# EAGLE design JuiceBoard.3.9.2020 (EAGLE 9.1.3)
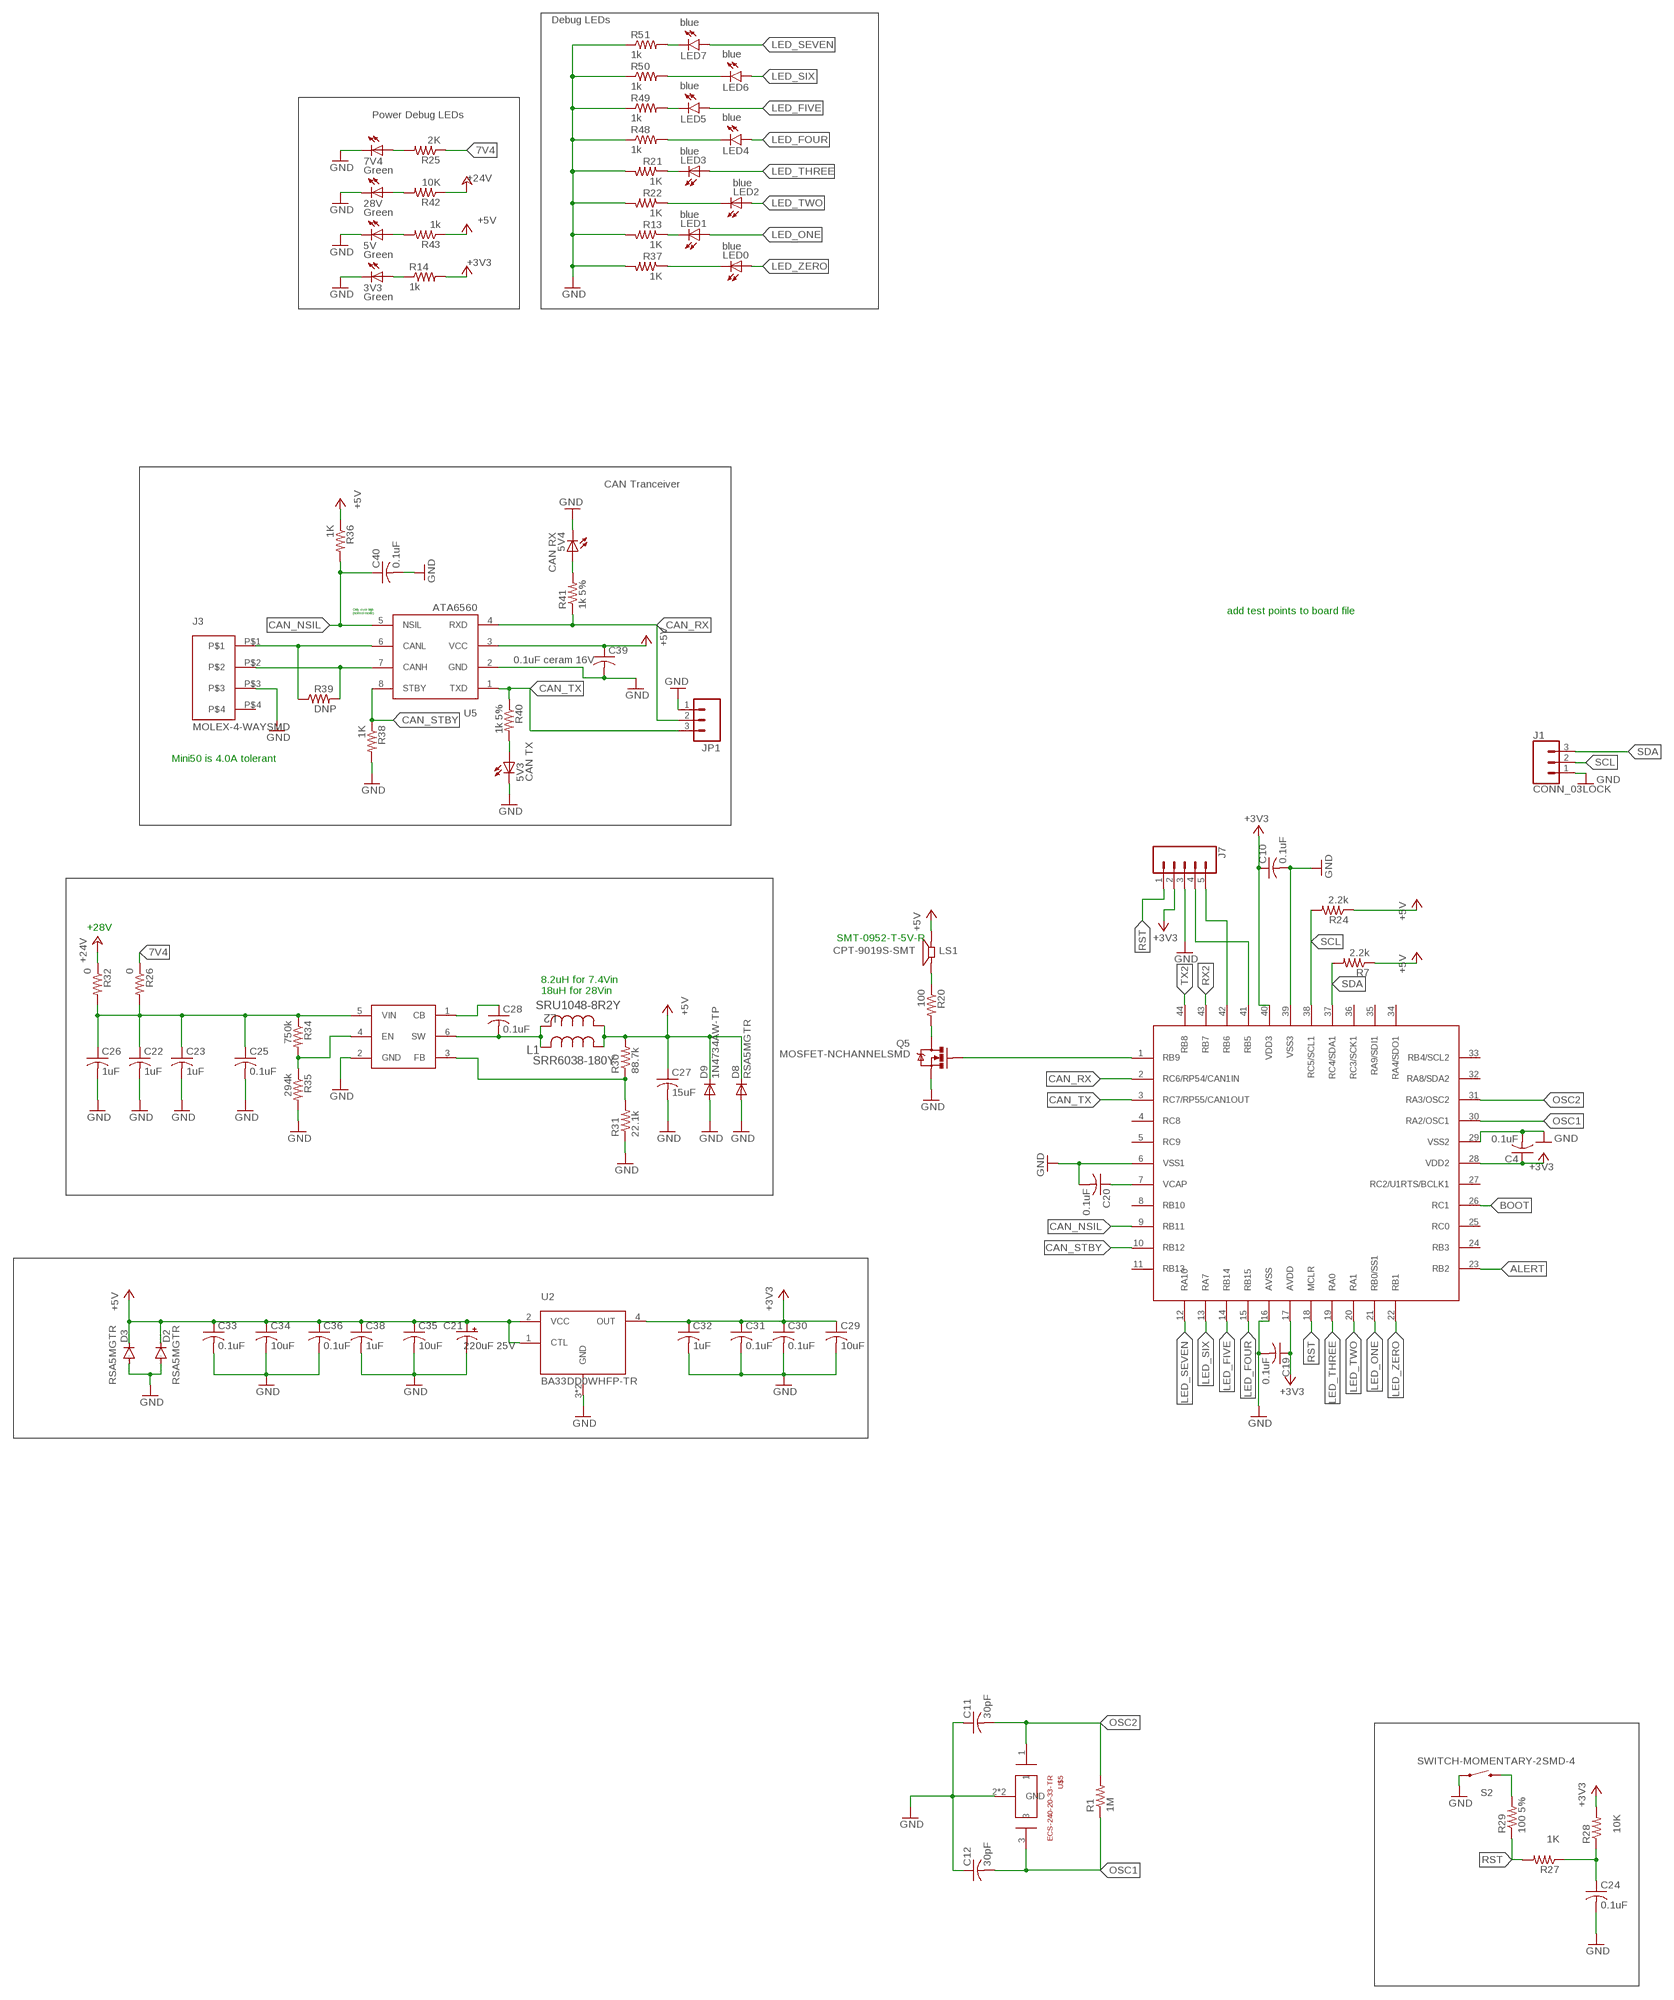
[diagram p0: schematic, sheet 1, part 1 of 2]
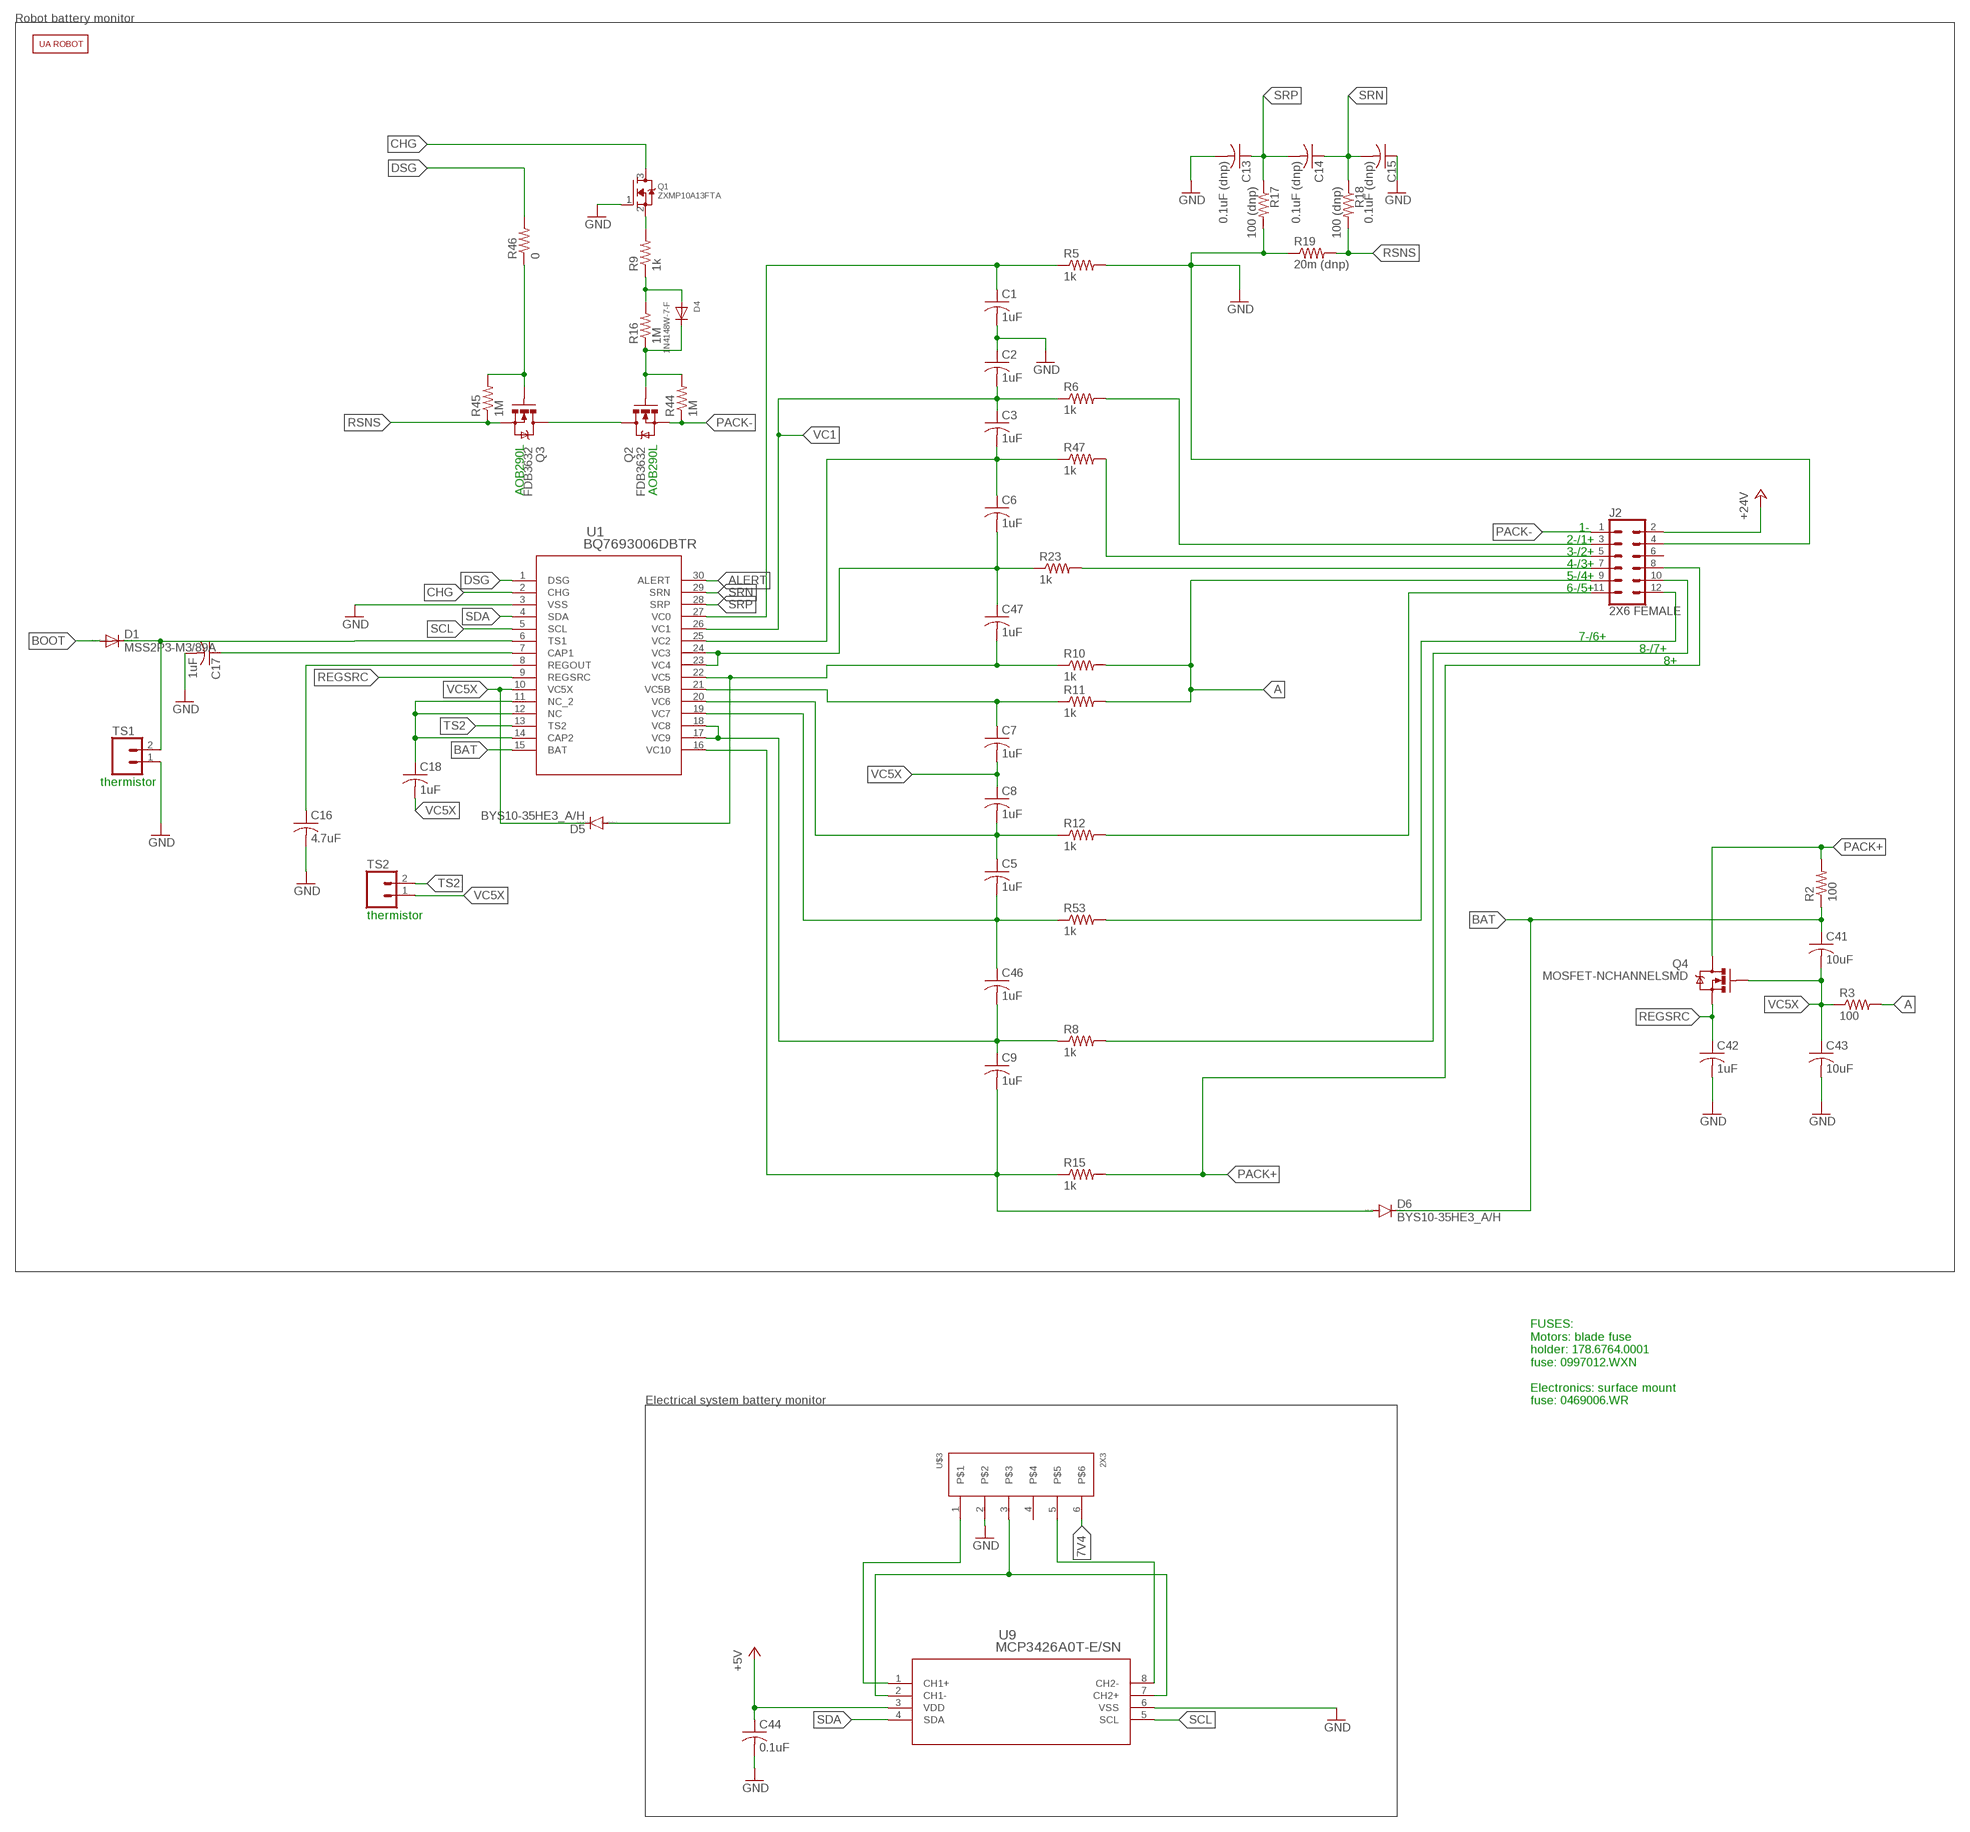
[diagram p1: schematic, sheet 1, part 2 of 2]

## Parts
3V3  Green  LEDCHIPLED_0805  [CHIPLED_0805]
5V  Green  LEDCHIP-LED0805  [CHIP-LED0805]
5V3  CAN TX  LEDCHIP-LED0805  [CHIP-LED0805]
5V4  CAN RX  LEDCHIP-LED0805  [CHIP-LED0805]
7V4  Green  LEDCHIP-LED0805  [CHIP-LED0805]
28V  Green  LEDCHIP-LED0805  [CHIP-LED0805]
A1  NASA_LOGO  [ROOBOT1]
C1  1uF  C-USC0805  [C0805]
C2  1uF  C-USC0805  [C0805]
C3  1uF  C-USC0805  [C0805]
C4  0.1uF  C-USC0805  [C0805]
C5  1uF  C-USC0805  [C0805]
C6  1uF  C-USC0805  [C0805]
C7  1uF  C-USC0805  [C0805]
C8  1uF  C-USC0805  [C0805]
C9  1uF  C-USC0805  [C0805]
C10  0.1uF  C-USC0805  [C0805]
C11  30pF  C-US_0805C0805  [C0805]
C12  30pF  C-US_0805C0805  [C0805]
C13  0.1uF (dnp)  C-USC0805  [C0805]
C14  0.1uF (dnp)  C-USC0805  [C0805]
C15  0.1uF (dnp)  C-USC0805  [C0805]
C16  4.7uF  C-USC0805  [C0805]
C17  1uF  C-USC0805  [C0805]
C18  1uF  C-USC0805  [C0805]
C19  0.1uF  C-USC0805  [C0805]
C20  0.1uF  C-USC0805  [C0805]
C21  220uF 25V  CPOL-US140CLH-1014  [140CLH-1014]
C22  1uF  C-USC0805  [C0805]
C23  1uF  C-USC0805  [C0805]
C24  0.1uF  C-USC0805  [C0805]
C25  0.1uF  C-USC0805  [C0805]
C26  1uF  C-USC0805  [C0805]
C27  15uF  C-USC0805  [C0805]
C28  0.1uF  C-USC0805  [C0805]
C29  10uF  C-USC0805  [C0805]
C30  0.1uF  C-USC0805  [C0805]
C31  0.1uF  C-USC0805  [C0805]
C32  1uF  C-USC0805  [C0805]
C33  0.1uF  C-USC0805  [C0805]
C34  10uF  C-USC0805  [C0805]
C35  10uF  C-USC0805  [C0805]
C36  0.1uF  C-USC0805  [C0805]
C38  1uF  C-USC0805  [C0805]
C39  0.1uF ceram 16V  C-USC0805  [C0805]
C40  0.1uF  C-USC0805  [C0805]
C41  10uF  C-US_0805C0805  [C0805]
C42  1uF  C-US_0805C0805  [C0805]
C43  10uF  C-US_0805C0805  [C0805]
C44  0.1uF  C-US_0805C0805  [C0805]
C46  1uF  C-USC0805  [C0805]
C47  1uF  C-USC0805  [C0805]
D1  MSS2P3-M3/89A  DIODE-SOD123  [SOD123]
D2  RSA5MGTR  CGRM4004-G  [SOD-123_MINI-SMA]
D3  RSA5MGTR  CGRM4004-G  [SOD-123_MINI-SMA]
D4  1N4148W-7-F  DIODESOD-123  [SOD-123]
D5  BYS10-35HE3_A/H  DIODE-DO214AC  [DO214AC]
D6  BYS10-35HE3_A/H  DIODE-DO214AC  [DO214AC]
D8  RSA5MGTR  DIODE-SOD123  [SOD123]
D9  1N4734AW-TP  DIODE-SOD123  [SOD123]
J1  CONN_03LOCK  [1X03_LOCK]
J2  2X6 FEMALE  CONN_06X2PTH_FEMALE  [2X6]
J3  MOLEX-4-WAYSMD  [4-WAY-SMD-90D]
J7  CONN_05  [1X05]
JP1  M03LOCK  [1X03_LOCK]
L1  SRR6038-180Y  [IND_BOURNS_SRR6038]
L2  SRU1048-8R2Y  [IND_BOURNS_SRU1048]
LED0  blue  LEDCHIPLED_0805  [CHIPLED_0805]
LED1  blue  LEDCHIPLED_0805  [CHIPLED_0805]
LED2  blue  LEDCHIPLED_0805  [CHIPLED_0805]
LED3  blue  LEDCHIPLED_0805  [CHIPLED_0805]
LED4  blue  LEDS_0805CHIP-LED0805  [CHIP-LED0805]
LED5  blue  LEDS_0805CHIP-LED0805  [CHIP-LED0805]
LED6  blue  LEDS_0805CHIP-LED0805  [CHIP-LED0805]
LED7  blue  LEDS_0805CHIP-LED0805  [CHIP-LED0805]
LS1  CPT-9019S-SMT  [CUI_CPT-9019S-SMT]
Q1  ZXMP10A13FTA  MOSFET-NREFLOW  [SOT23]
Q2  FDB3632  [TO-263-2]
Q3  FDB3632  [TO-263-2]
Q4  MOSFET-NCHANNELSMD  [SOT23-3]
Q5  MOSFET-NCHANNELSMD  [SOT23-3]
R1  1M  R-US_0805R0805  [R0805]
R2  100  R-US_0805R0805  [R0805]
R3  100  R-US_0805R0805  [R0805]
R5  1k  R-US_M0805  [M0805]
R6  1k  R-US_M0805  [M0805]
R7  2.2k  R-US_0805R0805  [R0805]
R8  1k  R-US_M0805  [M0805]
R9  1k  R-US_0805R0805  [R0805]
R10  1k  R-US_M0805  [M0805]
R11  1k  R-US_M0805  [M0805]
R12  1k  R-US_M0805  [M0805]
R13  1K  R-US_M0805  [M0805]
R14  1k  R-US_M0805  [M0805]
R15  1k  R-US_M0805  [M0805]
R16  1M  R-US_0805R0805  [R0805]
R17  100 (dnp)  R-US_M0805  [M0805]
R18  100 (dnp)  R-US_M0805  [M0805]
R19  20m (dnp)  R-US_M0805  [M0805]
R20  100  R-US_M0805  [M0805]
R21  1K  R-US_M0805  [M0805]
R22  1K  R-US_M0805  [M0805]
R23  1k  R-US_M0805  [M0805]
R24  2.2k  R-US_0805R0805  [R0805]
R25  2K  R-US_M0805  [M0805]
R26  0  R-US_M0805  [M0805]
R27  1K  R-US_M0805  [M0805]
R28  10K  R-US_M0805  [M0805]
R29  100 5%  R-US_M0805  [M0805]
R30  88.7k  R-US_M0805  [M0805]
R31  22.1k  R-US_M0805  [M0805]
R32  0  R-US_M0805  [M0805]
R34  750k  R-US_M0805  [M0805]
R35  294k  R-US_M0805  [M0805]
R36  1K  R-US_M0805  [M0805]
R37  1K  R-US_M0805  [M0805]
R38  1K  R-US_M0805  [M0805]
R39  DNP  R-US_M0805  [M0805]
R40  1k 5%  R-US_M0805  [M0805]
R41  1k 5%  R-US_M0805  [M0805]
R42  10K  R-US_M0805  [M0805]
R43  1k  R-US_M0805  [M0805]
R44  1M  R-US_0805R0805  [R0805]
R45  1M  R-US_0805R0805  [R0805]
R46  0  R-US_0805R0805  [R0805]
R47  1k  R-US_M0805  [M0805]
R48  1k  R-US_0805R0805  [R0805]
R49  1k  R-US_0805R0805  [R0805]
R50  1k  R-US_0805R0805  [R0805]
R51  1k  R-US_0805R0805  [R0805]
R53  1k  R-US_M0805  [M0805]
S2  SWITCH-MOMENTARY-2SMD-4  [TACTILE_SWITCH_TALL]
TS1  CONN_02  [1X02]
TS2  CONN_02  [1X02]
U1  BQ7693006DBTR  [DBT30]
U2  BA33DD0WHFP-TR  [HRP5]
U3  DSPIC33EP512GM604  [TQFP-44]
U5  ATA6560  [SOIC8]
U7  TPS560430YDBVR  [SOT23-6]
U9  MCP3426A0T-E/SN  [SOIC8-N_MC]
U$3  2X3  [2X3]
U$5  ECS-240-20-33-TR  [ECX-32]

## Nets
7V4: R25.1 R26.1 U$3.6
+3V3: C4.1 C10.1 C19.1 C29.1 C30.1 C31.1 C32.1 J7.2 R14.2 R28.2 U2.4(OUT) U3.17(AVDD) U3.28(VDD2) U3.40(VDD3)
+5V [New Class]: C21.+ C27.1 C33.1 C34.1 C35.1 C36.1 C38.1 C39.1 C44.1 D2.C D3.C D8.C D9.C L1.1 L2.1 LS1.2 R7.1 R24.1 R30.2 R36.1 R43.1 U2.1(CTL) U2.2(VCC) U5.3(VCC) U9.3(VDD)
+24V [New Class]: J2.2 R32.1 R42.1
A: J2.9 R3.2 R10.2 R11.2
ALERT: U1.30(ALERT) U3.23(RB2)
BAT: C41.1 D6.C R2.1 U1.15(BAT)
BOOT: D1.A U3.26(RC1)
CAN_NSIL [New Class]: C40.1 R36.2 U3.9(RB11) U5.5(NSIL)
CAN_RX [New Class]: JP1.2 R41.1 U3.2(RC6/RP54/CAN1IN) U5.4(RXD)
CAN_STBY [New Class]: R38.1 U3.10(RB12) U5.8(STBY)
CAN_TX [New Class]: JP1.3 R40.1 U3.3(RC7/RP55/CAN1OUT) U5.1(TXD)
CHG: Q1.3(D) U1.2(CHG)
DSG: R46.2 U1.1(DSG)
GND: 3V3.C 5V3.C 5V4.C 5V.C 7V4.C 28V.C C1.2 C2.1 C4.2 C10.2 C11.1 C12.1 C13.2 C15.1 C16.2 C17.2 C19.2 C20.2 C21.- C22.2 C23.2 C24.2 C25.2 C26.2 C27.2 C29.2 C30.2 C31.2 C32.2 C33.2 C34.2 C35.2 C36.2 C38.2 C39.2 C40.2 C42.2 C43.2 C44.2 D2.A D3.A D8.A D9.A J1.1 J2.4 J3.P$3 J7.3 JP1.1 Q1.1(G) Q5.2(S) R5.2 R13.2 R17.2 R19.1 R21.2 R22.2 R31.1 R35.2 R37.2 R38.2 R48.1 R49.1 R50.1 R51.1 S2.A2 TS1.1 U1.3(VSS) U2.3(GND) U2.G(GND) U3.6(VSS1) U3.16(AVSS) U3.29(VSS2) U3.39(VSS3) U5.2(GND) U7.2(GND) U9.6(VSS) U$3.2 U$5.2(GND) U$5.4(GND)
LED_FIVE: LED5.A U3.14(RB14)
LED_FOUR: LED4.A U3.15(RB15)
LED_ONE [New Class]: LED1.A U3.21(RB0/SS1)
LED_SEVEN: LED7.A U3.12(RA10)
LED_SIX: LED6.A U3.13(RA7)
LED_THREE [New Class]: LED3.A U3.19(RA0)
LED_TWO [New Class]: LED2.A U3.20(RA1)
LED_ZERO [New Class]: LED0.A U3.22(RB1)
N$1: Q5.1(G) U3.1(RB9)
N$2: Q5.3(D) R20.2
N$3: C16.1 U1.8(REGOUT)
N$4: C3.2 C6.1 R47.1 U1.25(VC2)
N$5: C7.1 R11.1 U1.21(VC5B)
N$6: C1.1 R5.1 U1.27(VC0)
N$7 [New Class]: J7.5 U3.42(RB6)
N$8: Q1.2(S) R9.2
N$9 [New Class]: J7.4 U3.41(RB5)
N$10: C5.1 C8.2 R12.1 U1.20(VC6)
N$11: D4.A R9.1 R16.2
N$12: J2.12 R53.2
N$13: C9.1 C46.2 R8.1 U1.17(VC9) U1.18(VC8)
N$14: LED7.C R51.2
N$15: D4.C Q2.3(G) R16.1 R44.2
N$16: C9.2 D6.A R15.1 U1.16(VC10)
N$17: LED6.C R50.2
N$18: J2.3 R6.2
N$19: Q2.1(D) Q3.1(D)
N$20: C47.2 D5.A R10.1 U1.22(VC5)
N$21: C18.1 U1.11(NC_2) U1.12(NC) U1.14(CAP2)
N$22: J2.11 R12.2
N$23: 7V4.A R25.2
N$24: J2.10 R8.2
N$25: J2.5 R47.2
N$26: D1.C TS1.2 U1.6(TS1)
N$27 [New Class]: C22.1 C23.1 C25.1 C26.1 R26.2 R32.2 R34.1 U7.5(VIN)
N$28: C17.1 U1.7(CAP1)
N$29: C6.2 C47.1 R23.1 U1.23(VC4) U1.24(VC3)
N$30: Q3.3(G) R45.2 R46.1
N$31: LS1.1 R20.1
N$32: 3V3.A R14.1
N$33: LED5.C R49.2
N$36: J2.7 R23.2
N$37 [New Class]: C20.1 U3.7(VCAP)
N$40: LED4.C R48.2
N$41: LED3.C R21.1
N$42: LED2.C R22.1
N$43: LED1.C R13.1
N$44: LED0.C R37.1
N$49 [New Class]: C24.1 R27.1 R28.1
N$50 [New Class]: R29.2 S2.B2
N$51 [New Class]: C28.2 L1.2 L2.2 U7.6(SW)
N$52 [New Class]: C28.1 U7.1(CB)
N$53 [New Class]: R30.1 R31.2 U7.3(FB)
N$54 [New Class]: R34.2 R35.1 U7.4(EN)
N$56 [New Class]: J3.P$2 R39.2 U5.7(CANH)
N$57 [New Class]: 5V3.A R40.2
N$58 [New Class]: 5V4.A R41.2
N$59 [New Class]: J3.P$1 R39.1 U5.6(CANL)
N$61 [New Class]: 28V.A R42.2
N$62 [New Class]: 5V.A R43.2
N$63: U9.1(CH1+) U$3.1
N$64: U9.2(CH1-) U9.7(CH2+) U$3.3
N$65: U9.8(CH2-) U$3.5
N$66: C5.2 C46.1 R53.1 U1.19(VC7)
OSC1: C12.2 R1.1 U3.30(RA2/OSC1) U$5.3
OSC2: C11.2 R1.2 U3.31(RA3/OSC2) U$5.1
PACK+: J2.8 Q4.3(D) R2.2 R15.2
PACK-: J2.1 Q2.TAB(S) R44.1
REGSRC: C42.1 Q4.2(S) U1.9(REGSRC)
RSNS: Q3.TAB(S) R18.2 R19.2 R45.1
RST [New Class]: J7.1 R27.2 R29.1 U3.18(MCLR)
RX2 [New Class]: U3.43(RB7)
SCL: J1.2 R24.2 U1.5(SCL) U3.38(RC5/SCL1) U9.5(SCL)
SDA: J1.3 R7.2 U1.4(SDA) U3.37(RC4/SDA1) U9.4(SDA)
SRN: C14.1 C15.2 R18.1 U1.29(SRN)
SRP: C13.1 C14.2 R17.1 U1.28(SRP)
TS2: TS2.2 U1.13(TS2)
TX2 [New Class]: U3.44(RB8)
VC1: C2.2 C3.1 R6.1 U1.26(VC1)
VC5X: C7.2 C8.1 C18.2 C41.2 C43.1 D5.C Q4.1(G) R3.1 TS2.1 U1.10(VC5X)
Unconnected: J2.6 J3.P$4 U3.4(RC8) U3.5(RC9) U3.8(RB10) U3.11(RB13) U3.24(RB3) U3.25(RC0) U3.27(RC2/U1RTS/BCLK1) U3.32(RA8/SDA2) U3.33(RB4/SCL2) U3.34(RA4/SDO1) U3.35(RA9/SDI1) U3.36(RC3/SCK1) U$3.4

## Notes on the sheet
- Debug LEDs
- Power Debug LEDs
- Robot battery monitor
- CAN Tranceiver
- Only ever high 
    (normal mode)
- add test points to board file
- Mini50 is 4.0A tolerant
- AOB290L | AOB290L
- 1-
- 2-/1+
- 3-/2+
- 4-/3+
- 5-/4+
- 6-/5+
- +28V
- SMT-0952-T-5V-R | 7-/6+
- 8-/7+
- 8+
- 8.2uH for 7.4Vin
  18uH for 28Vin
- thermistor
- thermistor
- Electrical system battery monitor
- FUSES:
  Motors: blade fuse
  holder: 178.6764.0001
  fuse: 0997012.WXN
  
  Electronics: surface mount
  fuse: 0469006.WR

## Library data of the parts
3V3 5V 5V3 5V4 7V4 28V LED0 LED1-LED3 = adafruit:LED: LED OSRAM: - CHIPLED LG R971, LG N971, LY N971, LG Q971, LY Q971, LO R971, LY R971 LH N974, LH R974 LS Q976, LO Q976, LY Q976 LO Q996 - Hyper CHIPLED LW Q18S LB Q993, LB Q99A, LB R99A - SideLED LS A670, LO A670, LY A670, LG A670, LP A670 LB A673, LV A673, LT A673, LW A673 LH A674 LY A675 LS A676, LA A676, LO A676, LY A676, LW A676 LS A679, LY A679, LG A679 - Hyper Micro SIDELED® LS Y876, LA Y876, LO Y876, LY Y876 LT Y87S - SmartLED LW L88C, LW L88S LB L89C, LB L89S, LG L890 LS L89K, LO L89K, LY L89K LS L896, LA L896, LO L896, LY L896 - TOPLED LS T670, LO T670, LY T670, LG T670, LP T670 LSG T670, LSP T670, LSY T670, LOP T670, LYG T670 LG T671, LOG T671, LSG T671 LB T673, LV T673, LT T673, LW T673 LH T674 LS T676, LA T676, LO T676, LY T676, LB T676, LH T676, LSB T676, LW T676 LB T67C, LV T67C, LT T67C, LS T67K, LO T67K, LY T67K, LW E67C LS E67B, LA E67B, LO E67B, LY E67B, LB E67C, LV E67C, LT E67C LW T67C LS T679, LY T679, LG T679 LS T770, LO T770, LY T770, LG T770, LP T770 LB T773, LV T773, LT T773, LW T773 LH T774 LS E675, LA E675, LY E675, LS T675 LS T776, LA T776, LO T776, LY T776, LB T776 LHGB T686 LT T68C, LB T68C - Hyper Mini TOPLED® LB M676 - Mini TOPLED Santana® LG M470 LS M47K, LO M47K, LY M47K Source: http://www.osram.convergy.de/
A1 = UA_NASA_RMC-Logos:NASA_LOGO
C1-C10 C19 C20 C22-C36 C38-C40 C46 C47 = adafruit:C-US: CAPACITOR, American symbol
C11 C12 C41-C44 = UA_NASA_RMC-Capacitors:C-US_0805: CAPACITOR, American symbol; SPICEPREFIX: C
C13-C18 = rcl:C-US: CAPACITOR, American symbol; SPICEPREFIX: C
C21 = rcl:CPOL-US: POLARIZED CAPACITOR, American symbol
D1 D8 D9 = diode:DIODE-: DIODE
D2 D3 = diode:CGRM400*-G: Molded plasitc,JEDEC SOD-123/Mini SMA Source: Comchip CGRM4001-G.pdf
D4 = adafruit:DIODE: Diode SMADIODE - SMA Surface Mount Package 20V 1A Schottky Diode Digikey: 641-1014-6-ND DO-1N4148 - Through Hole Small Current Diode SOD-123 20V 1 A (.5mV Vf) Schottky Diode - Digikey: MBRX120TPMSCT-ND SOD-323 10V 570mA (.38mV Vf, 3ns) Schottky Diode - Digikey: ZLLS410CT-ND SOD-523 30V 30mA Schottky Diode (RB751S-40TE61) - Digikey: RB751S-40TE61CT-ND SOT23-R/W - SOT23 Package (R = Solder Paste/Reflow Ovens, W = Hand-Soldering) BAT54Film 40V 300mA - Digikey: 497-7162-1-ND
D5 D6 = UA_NASA_RMC-Diodes:DIODE-: DIODE
J1 = UA_NASA_RMC-Connectors:CONN_03: Multi connection point. Often used as Generic Header-pin footprint for 0.1 inch spaced/style header connections On any of the 0.1 inch spaced packages, you can populate with these: Break Away Headers - Straight <https://www.sparkfun.com/products/116> (PRT-00116) Break Away Male Headers - Right Angle <https://www.sparkfun.com/products/553> (PRT-00553) Female Headers <https://www.sparkfun.com/products/115> (PRT-00115) Break Away Headers - Machine Pin <https://www.sparkfun.com/products/117> (PRT-00117) Break Away Female Headers - Swiss Machine Pin <https://www.sparkfun.com/products/743> (PRT-00743) Stackable Header - 3 Pin (Female, 0.1") <https://www.sparkfun.com/products/13875> (PRT-13875) For SCREWTERMINALS and SPRING TERMINALS visit here: Screw Terimnals on SparkFun.com <https://www.sparkfun.com/search/results?term=Screw+Terminals> (5mm/3.5mm/2.54mm spacing) This device is also useful as a general connection point to wire up your design to another part of your project. Our various solder wires solder well into these plated through hole pads. Hook-Up Wire - Assortment (Stranded, 22 AWG) <https://www.sparkfun.com/products/11375> (PRT-11375) Hook-Up Wire - Assortment (Solid Core, 22 AWG) <https://www.sparkfun.com/products/11367> (PRT-11367) View the entire wire category on our website here <https://www.sparkfun.com/categories/141> Special notes: Molex polarized connector foot print use with SKU : PRT-08232 with associated crimp pins and housings.
J2 = UA_NASA_RMC-Connectors:CONN_06X2: Multi connection point. Often used as Generic Header-pin footprint for 0.1 inch spaced/style header connections On any of the 0.1 inch spaced packages, you can populate with these: Break Away Headers - Straight <https://www.sparkfun.com/products/116> (PRT-00116) Break Away Male Headers - Right Angle <https://www.sparkfun.com/products/553> (PRT-00553) Female Headers <https://www.sparkfun.com/products/115> (PRT-00115) Break Away Headers - Machine Pin <https://www.sparkfun.com/products/117> (PRT-00117) Break Away Female Headers - Swiss Machine Pin <https://www.sparkfun.com/products/743> (PRT-00743); PROD_ID: CONN-12423
J3 = UA_NASA_RMC-Connectors:MOLEX-4-WAY; MOUNTING_TYPE: Surface Mount; SUGGESTED_PART_NUMBER: 34912-6040
J7 = SparkFun-Connectors:CONN_05: Multi connection point. Often used as Generic Header-pin footprint for 0.1 inch spaced/style header connections On any of the 0.1 inch spaced packages, you can populate with these: Break Away Headers - Straight <https://www.sparkfun.com/products/116> (PRT-00116) Break Away Male Headers - Right Angle <https://www.sparkfun.com/products/553> (PRT-00553) Female Headers <https://www.sparkfun.com/products/115> (PRT-00115) Break Away Headers - Machine Pin <https://www.sparkfun.com/products/117> (PRT-00117) Break Away Female Headers - Swiss Machine Pin <https://www.sparkfun.com/products/743> (PRT-00743) For SCREWTERMINALS and SPRING TERMINALS visit here: Screw Terimnals on SparkFun.com <https://www.sparkfun.com/search/results?term=Screw+Terminals> (5mm/3.5mm/2.54mm spacing) This device is also useful as a general connection point to wire up your design to another part of your project. Our various solder wires solder well into these plated through hole pads. Hook-Up Wire - Assortment (Stranded, 22 AWG) <https://www.sparkfun.com/products/11375> (PRT-11375) Hook-Up Wire - Assortment (Solid Core, 22 AWG) <https://www.sparkfun.com/products/11367> (PRT-11367) View the entire wire category on our website here <https://www.sparkfun.com/categories/141> Special notes: Molex polarized connector foot print use with SKU : PRT-08231 with associated crimp pins and housings. 1MM SMD Version SKU: PRT-10208
JP1 = SparkFun-Connectors:M03: Header 3 Standard 3-pin 0.1" header. Use with straight break away headers (SKU : PRT-00116), right angle break away headers (PRT-00553), swiss pins (PRT-00743), machine pins (PRT-00117), and female headers (PRT-00115). Molex polarized connector foot print use with SKU : PRT-08232 with associated crimp pins and housings.
L1 = UA_NASA_RMC-Inductors:SRR6038-180Y; BUILT_BY: EMA_UL_Team; MANUFACTURER_PART_NUMBER: SRR6038-180Y; VENDOR: Bourns Electronics
L2 = UA_NASA_RMC-Inductors:SRU1048-8R2Y
LED4-LED7 = UA_NASA_RMC-Diodes:LEDS_0805: LED 0805 OSRAM: - CHIPLED LG R971, LG N971, LY N971, LG Q971, LY Q971, LO R971, LY R971 LH N974, LH R974 LS Q976, LO Q976, LY Q976 LO Q996 - Hyper CHIPLED LW Q18S LB Q993, LB Q99A, LB R99A - SideLED LS A670, LO A670, LY A670, LG A670, LP A670 LB A673, LV A673, LT A673, LW A673 LH A674 LY A675 LS A676, LA A676, LO A676, LY A676, LW A676 LS A679, LY A679, LG A679 - Hyper Micro SIDELED® LS Y876, LA Y876, LO Y876, LY Y876 LT Y87S - SmartLED LW L88C, LW L88S LB L89C, LB L89S, LG L890 LS L89K, LO L89K, LY L89K LS L896, LA L896, LO L896, LY L896 - TOPLED LS T670, LO T670, LY T670, LG T670, LP T670 LSG T670, LSP T670, LSY T670, LOP T670, LYG T670 LG T671, LOG T671, LSG T671 LB T673, LV T673, LT T673, LW T673 LH T674 LS T676, LA T676, LO T676, LY T676, LB T676, LH T676, LSB T676, LW T676 LB T67C, LV T67C, LT T67C, LS T67K, LO T67K, LY T67K, LW E67C LS E67B, LA E67B, LO E67B, LY E67B, LB E67C, LV E67C, LT E67C LW T67C LS T679, LY T679, LG T679 LS T770, LO T770, LY T770, LG T770, LP T770 LB T773, LV T773, LT T773, LW T773 LH T774 LS E675, LA E675, LY E675, LS T675 LS T776, LA T776, LO T776, LY T776, LB T776 LHGB T686 LT T68C, LB T68C - Hyper Mini TOPLED® LB M676 - Mini TOPLED Santana® LG M470 LS M47K, LO M47K, LY M47K Source: http://www.osram.convergy.de LUXEON: - LUMILED® LXK2-PW12-R00, LXK2-PW12-S00, LXK2-PW14-U00, LXK2-PW14-V00 LXK2-PM12-R00, LXK2-PM12-S00, LXK2-PM14-U00 LXK2-PE12-Q00, LXK2-PE12-R00, LXK2-PE12-S00, LXK2-PE14-T00, LXK2-PE14-U00 LXK2-PB12-K00, LXK2-PB12-L00, LXK2-PB12-M00, LXK2-PB14-N00, LXK2-PB14-P00, LXK2-PB14-Q00 LXK2-PR12-L00, LXK2-PR12-M00, LXK2-PR14-Q00, LXK2-PR14-R00 LXK2-PD12-Q00, LXK2-PD12-R00, LXK2-PD12-S00 LXK2-PH12-R00, LXK2-PH12-S00 LXK2-PL12-P00, LXK2-PL12-Q00, LXK2-PL12-R00 Source: www.luxeon.com KINGBRIGHT: KA-3528ASYC Source: www.kingbright.com
LS1 = CPT-9019S-SMT:CPT-9019S-SMT: 9 mm, 25 Vp-p Vdc, 65 dB, Surface Mount (SMT), Piezo Audio Transducer Buzzer; MANUFACTURER: CUI INC; PART_REV: 1.0; STANDARD: MANUFACTURER RECOMMENDATIONS
Q1 = adafruit:MOSFET-N: N-Channel Mosfet 2N7002E - 60V 260mA SOT23 [Digikey: 2N7002ET1GOSTR-ND] - REEL BSH103 - 30V 850mA SOT23 [Digikey: 568-5013-1-ND]
Q2 Q3 = UA_NASA_RMC-Transistors:FDB3632
Q4 Q5 = UA_NASA_RMC-Transistors:MOSFET-NCHANNEL
R1-R3 R7 R9 R16 R24 R44-R46 R48-R51 = UA_NASA_RMC-Resistors:R-US_0805: RESISTOR, American symbol; SPICEPREFIX: R
R5 R6 R8 R10-R13 R15 R21-R23 R25-R32 R34-R43 R47 R53 = adafruit:R-US_: RESISTOR, American symbol
R14 R17-R20 = rcl:R-US_: RESISTOR, American symbol; SPICEPREFIX: R
S2 = SparkFun-Electromechanical:SWITCH-MOMENTARY-2: Various NO switches- pushbuttons, reed, etc; PROD_ID: SWCH-11966
TS1 TS2 = SparkFun-Connectors:CONN_02: Multi connection point. Often used as Generic Header-pin footprint for 0.1 inch spaced/style header connections On any of the 0.1 inch spaced packages, you can populate with these: Break Away Headers - Straight <https://www.sparkfun.com/products/116> (PRT-00116) Break Away Male Headers - Right Angle <https://www.sparkfun.com/products/553> (PRT-00553) Female Headers <https://www.sparkfun.com/products/115> (PRT-00115) Break Away Headers - Machine Pin <https://www.sparkfun.com/products/117> (PRT-00117) Break Away Female Headers - Swiss Machine Pin <https://www.sparkfun.com/products/743> (PRT-00743) For SCREWTERMINALS and SPRING TERMINALS visit here: Screw Terimnals on SparkFun.com <https://www.sparkfun.com/search/results?term=Screw+Terminals> (5mm/3.5mm/2.54mm spacing) This device is also useful as a general connection point to wire up your design to another part of your project. Our various solder wires solder well into these plated through hole pads. Hook-Up Wire - Assortment (Stranded, 22 AWG) <https://www.sparkfun.com/products/11375> (PRT-11375) Hook-Up Wire - Assortment (Solid Core, 22 AWG) <https://www.sparkfun.com/products/11367> (PRT-11367) View the entire wire category on our website here <https://www.sparkfun.com/categories/141> Special notes: Molex polarized connector foot print use with: PRT-08233 with associated crimp pins and housings. 2.54_SCREWTERM for use with PRT-10571. 3.5mm Screw Terminal footprints for PRT-08084 5mm Screw Terminal footprints for use with PRT-08432
U1 = BQ7693006DBTR:BQ7693006DBTR: Battery Battery Monitor IC Multi-Chemistry 30-TSSOP; MANUFACTURER_PART_NUMBER: BQ7693006DBTR; VENDOR: Texas Instruments
U2 = NASA_LIB_08-24-17:BA33DD0WHFP-TR
U3 = UA_NASA_RMC-Microcontrollers:DSPIC33EP512GM604
U5 = NASAAtmel:ATA6560
U7 = adafruit_2:TPS560430YDBVR
U9 = UA_NASA_RMC-Microcontrollers:MCP3426A0T-E/SN; BUILT_BY: EMA_UL_Team; MANUFACTURER_PART_NUMBER: MCP3426A0T-E/SN; VENDOR: Microchip
U$3 = UA_NASA_RMC-Connectors:2X3
U$5 = UA_NASA_RMC-Oscillators:ECS-240-20-33-TR

## Board
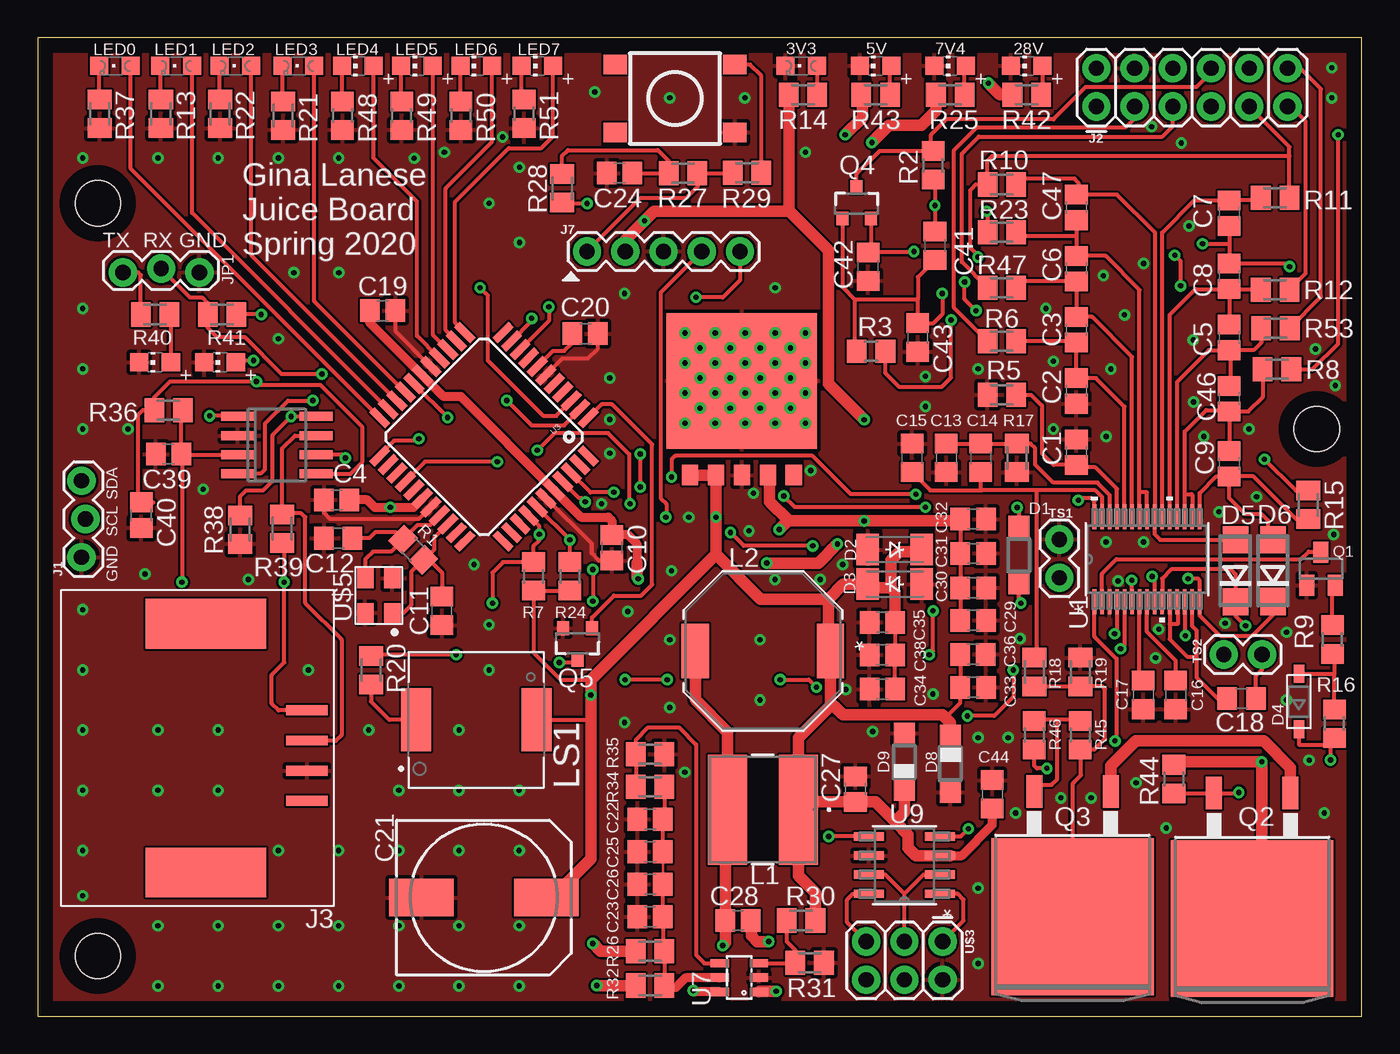
[diagram p2: board, top side]
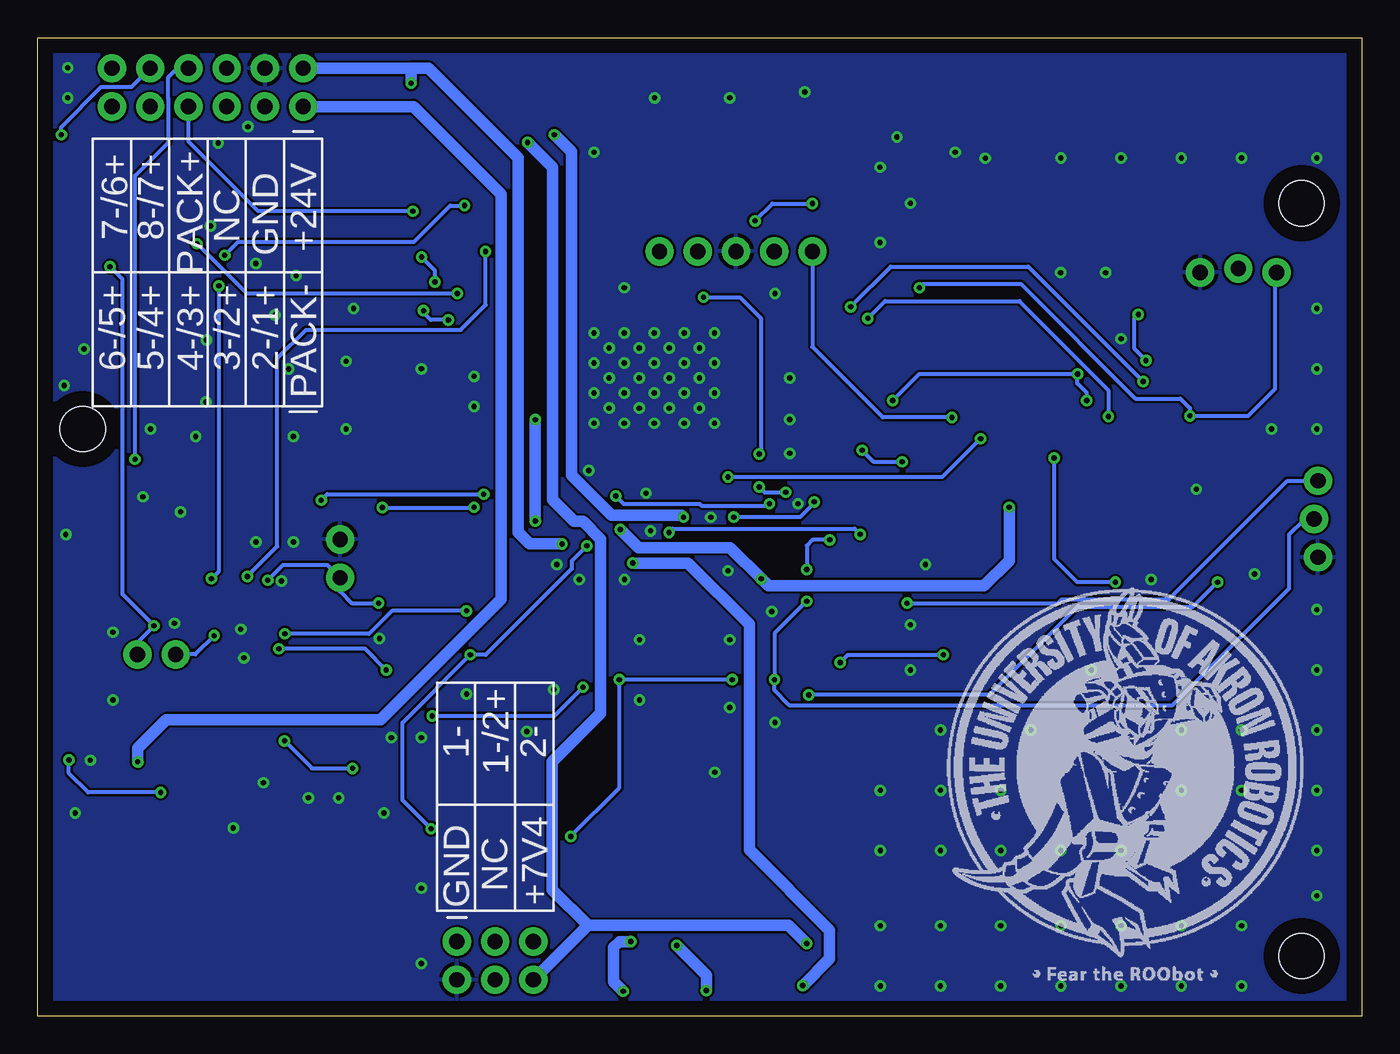
[diagram p3: board, bottom side, seen from below]

Size 88 x 65 mm. Coordinates in mm from the lower left corner, seen from the top.
Outline: 0,0 88,0 88,65 0,65 0,0
Copper layers (1*16): Top 0.035mm / dielectric 1.5mm / Bottom 0.035mm
Design rules "default": minimum track width 6mil, minimum drill 0.35mm, track to track 6mil, track to pad 6mil, pad to pad 6mil, via to via 6mil, smd to smd 6mil, copper to edge 40mil, drill to drill 6mil, minimum pad ring 10mil, minimum via ring 8mil, stop-mask expansion 4mil, vias tented up to drill 0mil, thermal gap 10mil
Holes 3 mm at 4,4 85,39 4,54

### Footprints (pad centres in the part's own frame; a part is rotated, then mirrored left to right if it is on the bottom)
CHIPLED_0805 = smd 1.2 x 1.2: A 0,-1.05; C 0,1.05
CHIP-LED0805 = smd 1.2 x 1.2: A 0,-1.05; C 0,1.05
C0805 = smd 1.3 x 1.5: 1 -0.85,0; 2 0.85,0
C0805' = smd 1.3 x 1.5: 1 -0.95,0; 2 0.95,0
140CLH-1014 = smd 4.3 x 2.5: + 4.15,0; - -4.15,0
SOD123 = smd 1.4 x 1.4: A 1.9,0; C -1.9,0
SOD-123_MINI-SMA = smd 1.5 x 2.1: A 1.8,0; C -1.8,0
SOD-123 = smd 1.2 x 0.7: A 1.85,0; C -1.85,0
DO214AC = smd 1.8 x 1.7: A 2.05,0; C -2.05,0
1X03_LOCK = drill 1.016 pad 1.88: 1 0,0.127; 2 2.54,-0.127; 3 5.08,0.127
2X6 = drill 1.016 pad 1.88: 1 0,0; 2 0,2.54; 3 2.54,0; 4 2.54,2.54; 5 5.08,0; 6 5.08,2.54; 7 7.62,0; 8 7.62,2.54; 9 10.16,0; 10 10.16,2.54; 11 12.7,0; 12 12.7,2.54
4-WAY-SMD-90D = smd 2.75 x 0.66: P$1 6.72,2.5; P$2 6.72,0.5; P$3 6.72,-1.5; P$4 6.72,-3.5 | smd 8 x 3.32: P$5 0,8.27; P$6 0,-8.27
1X05 = drill 1.016 pad 1.88: 1 0,0; 2 2.54,0; 3 5.08,0; 4 7.62,0; 5 10.16,0
IND_BOURNS_SRR6038 = smd 2.591 x 7.29: 1 -2.349,0; 2 2.349,0
IND_BOURNS_SRU1048 = smd 1.803 x 3.607: 1 -4.496,0; 2 4.496,0
CUI_CPT-9019S-SMT = smd 4.2 x 2: 1 0,4; 2 0,-4
SOT23 = smd 1 x 1.4: 1 -0.95,-1.1; 2 0.95,-1.1; 3 0,1.1
TO-263-2 = smd 1.067 x 2.159: 1 -2.54,-7.061; 3 2.54,-7.061 | smd 10.8 x 10.41: TAB 0,1.27
SOT23-3 = smd 0.8 x 0.9: 1 -0.95,-1; 2 0.95,-1; 3 0,1.1
R0805 = smd 1.3 x 1.5: 1 -0.95,0; 2 0.95,0
M0805 = smd 1.3 x 1.6: 1 -0.95,0; 2 0.95,0
TACTILE_SWITCH_TALL = smd 1.55 x 1.3: A1 -3.975,-2.25; A2 3.975,-2.25; B1 -3.975,2.25; B2 3.975,2.25
1X02 = drill 1.016 pad 1.88: 1 0,0; 2 2.54,0
DBT30 = smd 1.665 x 0.239: 1 -2.819,3.5; 2 -2.819,3; 3 -2.819,2.5; 4 -2.819,2; 5 -2.819,1.5; 6 -2.819,1; 7 -2.819,0.5; 8 -2.819,0; 9 -2.819,-0.5; 10 -2.819,-1; 11 -2.819,-1.5; 12 -2.819,-2; 13 -2.819,-2.5; 14 -2.819,-3; 15 -2.819,-3.5; 16 2.819,-3.5; 17 2.819,-3; 18 2.819,-2.5; 19 2.819,-2; 20 2.819,-1.5; 21 2.819,-1; 22 2.819,-0.5; 23 2.819,0; 24 2.819,0.5; 25 2.819,1; 26 2.819,1.5; 27 2.819,2; 28 2.819,2.5; 29 2.819,3; 30 2.819,3.5
HRP5 = smd 1.07 x 1.37: 1 -3.44,0; 2 -1.72,0; 3 0,0; 4 1.72,0; 5 3.44,0 | smd 10 x 9: G 0,6.254
TQFP-44 = smd 1.5 x 0.5: 1 -5.8,4; 2 -5.8,3.2; 3 -5.8,2.4; 4 -5.8,1.6; 5 -5.8,0.8; 6 -5.8,0; 7 -5.8,-0.8; 8 -5.8,-1.6; 9 -5.8,-2.4; 10 -5.8,-3.2; 11 -5.8,-4; 23 5.8,-4; 24 5.8,-3.2; 25 5.8,-2.4; 26 5.8,-1.6; 27 5.8,-0.8; 28 5.8,0; 29 5.8,0.8; 30 5.8,1.6; 31 5.8,2.4; 32 5.8,3.2; 33 5.8,4 | smd 0.5 x 1.5: 12 -4,-5.8; 13 -3.2,-5.8; 14 -2.4,-5.8; 15 -1.6,-5.8; 16 -0.8,-5.8; 17 0,-5.8; 18 0.8,-5.8; 19 1.6,-5.8; 20 2.4,-5.8; 21 3.2,-5.8; 22 4,-5.8; 34 4,5.8; 35 3.2,5.8; 36 2.4,5.8; 37 1.6,5.8; 38 0.8,5.8; 39 0,5.8; 40 -0.8,5.8; 41 -1.6,5.8; 42 -2.4,5.8; 43 -3.2,5.8; 44 -4,5.8
SOIC8 = smd 0.6 x 2.2: 1 -1.905,-2.6; 2 -0.635,-2.6; 3 0.635,-2.6; 4 1.905,-2.6; 5 1.905,2.6; 6 0.635,2.6; 7 -0.635,2.6; 8 -1.905,2.6
SOT23-6 = smd 0.55 x 1.2: 1 -0.95,-1.3; 2 0,-1.3; 3 0.95,-1.3; 4 0.95,1.3; 5 0,1.3; 6 -0.95,1.3
SOIC8-N_MC = smd 1.981 x 0.559: 1 -2.362,1.905; 2 -2.362,0.635; 3 -2.362,-0.635; 4 -2.362,-1.905; 5 2.362,-1.905; 6 2.362,-0.635; 7 2.362,0.635; 8 2.362,1.905
2X3 = drill 1.016 pad 1.88: 1 0,0; 2 0,2.54; 3 2.54,0; 4 2.54,2.54; 5 5.08,0; 6 5.08,2.54
ECX-32 = smd 1.3 x 1.1: 1 -1.15,-0.9; 2 1.15,-0.9; 3 1.15,0.9; 4 -1.15,0.9

### Placement (x,y rotation side)
3V3  50.74,63.12 90 top
5V  55.69,63.12 90 top
5V3  7.81,43.43 90 top
5V4  12.13,43.43 90 top
7V4  60.64,63.12 90 top
28V  65.72,63.12 90 top
A1  22.1,3.94 0 bottom
C1  69.03,37.47 90 top
C2  69.03,41.53 90 top
C3  69.03,45.59 90 top
C4  19.88,34.29 180 top
C5  79.19,45.09 270 top
C6  69.03,49.66 90 top
C7  79.19,53.34 270 top
C8  79.19,49.15 270 top
C9  79.19,36.7 270 top
C10  38.16,31.11 270 top
C11  30pF  [C0805']  26.86,26.92 90 top
C12  30pF  [C0805']  19.98,31.75 0 top
C13  0.1uF (dnp)  [C0805']  60.39,37.08 270 top
C14  0.1uF (dnp)  [C0805']  62.67,37.08 90 top
C15  0.1uF (dnp)  [C0805']  58.1,37.08 270 top
C16  4.7uF  [C0805']  75.63,21.34 270 top
C17  1uF  [C0805']  73.47,21.34 270 top
C18  1uF  [C0805']  80,21.1 0 top
C19  22.93,46.86 0 top
C20  36.39,45.34 0 top
C21  29.66,7.87 0 top
C22  40.7,13.08 180 top
C23  40.7,6.6 180 top
C24  38.67,56.01 180 top
C25  40.7,10.92 180 top
C26  40.7,8.76 180 top
C27  54.35,15.08 90 top
C28  46.55,6.35 180 top
C29  62.17,26.29 0 top
C30  62.17,28.45 0 top
C31  62.17,30.73 0 top
C32  62.17,33.02 0 top
C33  62.17,21.84 0 top
C34  56.13,21.72 180 top
C35  56.13,26.16 180 top
C36  62.16,24.03 0 top
C38  56.13,24 180 top
C39  8.7,37.34 180 top
C40  6.89,33.28 270 top
C41  10uF  [C0805']  59.63,51.18 270 top
C42  1uF  [C0805']  55.18,49.78 270 top
C43  10uF  [C0805']  58.48,45.09 270 top
C44  0.1uF  [C0805']  63.44,14.73 90 top
C46  79.19,41.02 270 top
C47  69.03,53.72 90 top
D1  65.2,30.63 90 top
D2  56.96,30.99 180 top
D3  56.96,28.7 0 top
D4  83.81,20.89 90 top
D5  79.6,29.59 90 top
D6  82.11,29.59 90 top
D8  60.64,16.76 270 top
D9  57.6,16.89 90 top
J1  3.05,30.48 90 top
J2  70.36,60.42 0 top
J3  11.18,17.81 0 top
J7  36.51,50.8 0 top
JP1  10.74,49.53 180 top
L1  48.2,13.72 180 top
L2  48.2,24.26 180 top
LED0  5.14,63.12 90 top
LED1  9.21,63.12 90 top
LED2  13.15,63.12 90 top
LED3  17.34,63.12 90 top
LED4  21.27,63.12 90 top
LED5  25.21,63.12 90 top
LED6  29.15,63.12 90 top
LED7  33.21,63.12 90 top
LS1  29.15,19.68 90 top
Q1  85.28,29.72 0 top
Q2  80.71,7.75 180 top
Q3  68.77,7.87 180 top
Q4  54.42,53.98 0 top
Q5  35.88,24.77 180 top
R1  24.96,30.99 315 top
R2  59.5,56.52 90 top
R3  55.39,44.17 0 top
R5  64.07,41.27 180 top
R6  64.07,44.83 180 top
R7  32.96,29.21 90 top
R8  82.36,42.96 0 top
R9  86.04,25.02 90 top
R10  64.07,55.24 180 top
R11  82.23,54.36 0 top
R12  82.23,48.26 0 top
R13  8.19,59.94 270 top
R14  50.87,61.21 180 top
R15  84.43,33.97 90 top
R16  86.17,19.43 90 top
R17  65.09,37.08 270 top
R18  66.23,22.86 270 top
R19  69.28,22.86 270 top
R20  22.16,22.99 90 top
R21  16.32,59.82 270 top
R22  12.13,59.94 270 top
R23  64.07,52.07 180 top
R24  35.37,29.21 90 top
R25  60.64,61.21 0 top
R26  40.7,4.32 0 top
R27  42.89,56 0 top
R28  34.86,54.99 270 top
R29  47.14,56.02 0 top
R30  50.74,6.35 0 top
R31  51.3,3.55 180 top
R32  40.7,2.03 0 top
R34  40.7,15.24 180 top
R35  40.7,17.4 0 top
R36  8.7,40.26 180 top
R37  4.13,59.94 270 top
R38  13.46,32.32 270 top
R39  16.26,32.38 90 top
R40  7.81,46.61 0 top
R41  12.25,46.61 0 top
R42  65.72,61.21 0 top
R43  55.69,61.21 0 top
R44  75.5,15.75 270 top
R45  69.28,18.67 90 top
R46  66.23,18.67 270 top
R47  64.07,48.39 180 top
R48  20.26,59.82 90 top
R49  24.2,59.82 90 top
R50  28.13,59.82 90 top
R51  32.32,59.94 90 top
R53  82.26,45.7 0 top
S2  42.36,60.96 0 top
TS1  67.9,31.66 270 top
TS2  81.36,24.02 180 top
U1  73.72,30.35 90 top
U2  46.8,35.94 0 top
U3  29.66,38.48 225 top
U5  15.9,37.93 270 top
U7  46.63,2.56 90 top
U9  57.6,10.03 180 top
U$3  60.14,4.95 180 top
U$5  22.67,27.94 90 top

### Tracks (layer width: path | path; a pad name or v marks a point on that pad's centre or on a via)
7V4  (via drill 0.35)
  Top 0.762: v55.44,58.04 56.58,59.18 58.74,59.18 59.69,60.14 R25.1 | v36.9,4.83 37.4,4.32 R26.1
  Bottom 0.762: U$3.6 51.44,6.03 | v55.44,58.04 53.79,56.39 53.79,34.29 52.36,32.86 51.75,32.86 50.58,31.7 50.58,20.13 53.8,16.91 53.8,8.39 51.44,6.03 | 51.44,6.03 38.1,6.03 v36.9,4.83
+3V3  (via drill 0.35)
  Top 0.254: C32.1 C31.1 C30.1 C29.1 | v36.51,53.98 34.93,53.98 R28.2
  Top 0.61: U3.28 24.96,33.78 24.45,33.78 23.43,33.78 | C4.1 21.91,34.29 22.42,33.78 23.43,33.78 | 23.43,33.78 v23.43,33.8 | 39.82,30.1 39.82,31.37 39.22,31.96 C10.1 38.16,32.89 37.91,33.15 36.13,33.15 U3.40 28.12,41.15 26.99,41.15 U3.17 22.07,46.07 C19.1
  Top 0.762: C32.1 61.19,32.89 v54.93,32.89 49.93,32.89 | R14.2 49.91,53.53 49.98,53.47 | v54.93,39.62 52.56,42 52.56,50.89 49.98,53.47 | 49.98,53.47 40.96,53.47 v40.32,52.83 39.05,51.56 J7.2 | U2.4 48.65,35.81 48.65,34.18 49.93,32.89 | 39.82,30.1 39.82,29.14 v39.91,29.05 | v49.28,32.32 49.85,32.89 49.93,32.89
  Bottom 0.254: v40.32,52.83 39.18,53.98 v36.51,53.98
  Bottom 0.762: v23.43,33.8 23.43,30.25 25.11,28.57 39.44,28.57 v39.91,29.05 41.98,31.11 48.07,31.11 v49.28,32.32 | v54.93,39.62 v54.93,32.89
+5V  (via drill 0.35)
  Top 0.254: R24.1 R7.1 32.96,24.13 34.74,22.35 36.77,22.35 | LS1.2 36.77,19.68 | R36.1 9.55,40.16 C39.1 9.59,37.3 9.65,37.3 | C35.1 C38.1 C34.1 | 60.11,20.02 60.54,20.02 61.32,20.8 C33.1 C36.1 | 9.65,37.3 U5.3 | v9.6,28.83 9.6,37.24 9.65,37.3
  Top 0.61: C44.1 63.44,12.7 61.41,10.67 60.64,10.67 U9.3
  Top 0.762: R30.2 51.69,8.19 50.55,9.34 L1.1 | L1.1 50.55,18.48 52.69,20.62 | L1.1 51.06,14.23 C27.1 55.69,14.23 56.99,12.92 | 60.64,10.67 58.36,10.67 57.85,11.18 57.85,12.06 56.99,12.92 | U2.1 U2.2 v45.08,33.15 45.08,30.68 45.09,30.67 | 45.09,30.67 48.05,27.71 52.54,27.71 | 56.71,28.45 55.41,28.45 D3.C 53.53,28.7 52.54,27.71 | 36.77,19.68 v36.77,21.34 | v36.77,21.34 36.77,10.46 34.19,7.87 C21.+ | v53.66,58.55 54.8,59.69 54.8,61.15 R43.1 | 56.99,12.92 57.6,13.53 D9.C | D2.C 58.63,30.86 57.28,30.86 56.71,30.29 56.71,28.45 | v36.77,21.34 36.77,22.35 45.09,30.67 | 56.71,28.45 56.98,28.17 C35.1 | 52.69,20.62 52.91,20.62 53.51,20.02 60.11,20.02 60.64,19.49 D8.C | 52.54,27.71 52.54,24.41 L2.1 52.69,20.62
  Bottom 0.254: v36.77,21.34 24.77,21.34 18.92,27.18 | 18.92,27.18 18.86,27.24 | 18.92,27.18 11.25,27.18 v9.6,28.83
  Bottom 0.762: v45.08,33.15 45.21,33.27 49.85,33.27 52.52,35.94 52.52,57.4 v53.66,58.55
+24V  (via drill 0.35)
  Top 0.762: v63.18,61.98 63.95,61.21 R42.1 | v37.15,2.03 R32.1 | v53.15,31.37 51.88,30.1 v48.45,30.1
  Bottom 0.762: J2.2 63.18,62.96 | 63.18,62.96 62.01,62.96 56.07,57.02 56.07,32.13 55.31,31.37 v53.15,31.37 | 63.18,62.96 v63.18,61.98 | v37.15,2.03 35.37,3.81 35.37,5.71 40.7,11.05 40.7,26.04 44.77,30.1 v48.45,30.1
A  (via drill 0.35)
  Top 0.254: R11.2 83.18,57.15 | 83.18,57.15 83.18,57.75 J2.9 | 83.18,57.15 63.44,57.15 63.12,56.84 R10.2 62.36,55.24 61.98,54.86 61.98,51.05 62.48,50.55 v62.48,50.42 | v60.71,46.25 60.71,42.42 60.07,41.78 57.28,41.78 56.34,42.72 R3.2 | v62.36,46.86 61.59,47.62 v61.59,48.77
  Bottom 0.254: v61.59,48.77 61.59,49.53 v62.48,50.42 | v60.71,46.25 61.87,46.25 62.36,46.74 v62.36,46.86
ALERT  (via drill 0.35)
  Top 0.254: U1.30 70.22,34.21 70.04,34.39 69.15,34.39 v69.15,34.27 | v58.36,34.67 54.04,34.67 51.5,37.21 42.36,37.21 42.12,36.98 v42.12,35.81 | v25.34,38.35 25.21,38.23 23.69,38.23 22.73,37.27 U3.23
  Bottom 0.254: v69.15,34.27 68.75,34.67 v58.36,34.67 | v42.12,35.81 27.88,35.81 v25.34,38.35
BAT  (via drill 0.35)
  Top 0.254: R2.1 59.63,55.44 v59.63,53.85 C41.1 | D6.C 82.11,26.67 80.71,25.27 78.55,25.27 77.22,26.6 U1.15 77.22,28.95 77.11,29.06 v76.45,29.06 | v75.95,48.51 75.95,50.16 v75.56,50.55
  Bottom 0.254: v76.45,29.06 75.95,29.57 v75.95,48.51 | v75.56,50.55 74.68,51.44 62.99,51.44 60.58,53.85 v59.63,53.85
BOOT  (via drill 0.35)
  Top 0.254: v65.09,33.78 65.2,33.67 D1.A | v58.99,33.8 50.31,33.8 v49.57,34.54 | v33.21,37.59 34.35,38.73 37.91,38.73 39.31,37.34 39.31,34.1 v39.37,34.04 | v30.55,36.83 25.75,36.83 U3.26
  Bottom 0.254: v65.09,33.78 59.02,33.78 v58.99,33.8 | v49.57,34.54 49.06,34.04 44.01,34.04 43.88,33.91 39.5,33.91 v39.37,34.04 | v33.21,37.59 32.45,36.83 v30.55,36.83
CAN_NSIL  (via drill 0.35)
  Top 0.254: C40.1 7.71,34.13 | C40.1 6.64,34.39 | v33.97,47.12 33.97,46.19 U3.9 | C40.1 6.67,34.36 6.67,39.94 6.99,40.26 R36.2 7.75,41.11 8.81,42.16 v14.54,42.16 14.8,41.91 18.8,41.91 21.59,39.12 21.59,36.83 20.79,36.03 U5.5
  Bottom 0.254: v14.54,42.16 22.16,49.78 31.31,49.78 v33.97,47.12
CAN_RX  (via drill 0.35)
  Top 0.254: v18.88,42.65 16.21,42.65 13.78,45.09 11.94,45.09 11.3,45.72 R41.1 11.3,47.37 10.92,47.75 10.11,47.75 JP1.2 | v31.18,40.89 32.83,39.24 34.99,39.24 36.02,40.28 U3.2 | U5.4 13.35,36.07 14.86,36.07 15.11,36.32 15.11,39.37 16.64,40.89 v18.29,40.89
  Bottom 0.254: 7.94,49.66 JP1.2 | v18.88,42.65 18.92,42.65 | 18.92,42.65 29.42,42.65 v31.18,40.89 | v18.29,40.89 18.29,41.4 18.92,42.04 18.92,42.65
CAN_STBY  (via drill 0.35)
  Top 0.254: v32.83,46.35 32.83,46.18 U3.10 | R38.1 13.46,34.54 13.84,34.92 14.99,34.92 15.62,35.56 15.62,38.61 v16.85,39.84 U5.8
  Bottom 0.254: v32.83,46.35 31.69,47.5 22.76,47.5 16.85,41.59 v16.85,39.84
CAN_TX  (via drill 0.35)
  Top 0.254: JP1.3 6.68,49.4 6.86,49.23 R40.1 | v29.4,48.39 29.91,47.88 29.91,43.56 33.59,39.88 34.45,39.88 U3.3 | U5.1 13.27,39.88 v11.43,39.88
  Bottom 0.254: JP1.3 5.78,49.29 5.78,41.66 7.56,39.88 v11.43,39.88 11.43,40.39 12.06,41.02 15.05,41.02 22.67,48.64 29.15,48.64 v29.4,48.39
CHG
  Top 0.254: 85.2,30.73 Q1.3 85.24,30.86 84.45,30.86 83.95,30.35 71.69,30.35 70.72,29.39 U1.2
DSG  (via drill 0.35)
  Top 0.254: v71.59,18.29 71.69,18.39 71.69,23.75 70.22,25.22 U1.1 | v67.07,16.46 66.41,16.46 66.23,16.64 R46.2
  Bottom 0.254: v71.59,18.29 69.76,16.46 v67.07,16.46
GND  (via drill 0.35)
  Top 0.254: U3.16 23.77,45.5 C19.2 | U3.6 34.87,43.69 36.58,43.69 37.24,44.35 C20.2 | C10.2 37.3,30.27 36.83,30.73 36.83,31.36 33.81,34.38 U3.39 | C4.2 19.03,33.42 19.41,33.05 25.36,33.05 U3.29
  other vias: 49.02,48.39 43.02,45.39 45.02,45.39 47.02,45.39 49.02,45.39 51.02,45.39 44.02,44.39 46.02,44.39 48.02,44.39 50.02,44.39 51.02,43.39 49.02,43.39 47.02,43.39 45.02,43.39 43.02,43.39 44.02,42.39 46.02,42.39 48.02,42.39 50.02,42.39 51.02,41.39 49.02,41.39 47.02,41.39 45.02,41.39 43.02,41.39 44.02,40.39 46.02,40.39 48.02,40.39 50.02,40.39 51.02,39.39 49.02,39.39 47.02,39.39 45.02,39.39 43.02,39.39 8,57 12,57 16,57 20,57 25.02,56.99 32.02,56.39 37.02,61.39 42,61 47,61 16,45 3,47 3,43 3,39 6,39 3,27 3,23 3,19 3,15 3,11 3,8 8,2 12,2 16,2 20,2 24,2 28,2 32,2 8,6 12,6 16,6 20,6 24,6 28,6 32,6 16,11 20,11 24,11 28,11 32,11 8,15 12,15 24,15 28,15 32,15 8,19 12,19 22,19 28,19 18,23 30,23 29,30 30,26 7.13,29.36 11,35 14,29 42,25 17.02,49.39 20.02,49.39 30,54 32.02,51.39 51.02,57.39 27.02,57.39 3,57 38.02,42.39 39,48 48,25 48,21 49,29 52,29 53.5,30 59,42.5 59,40.5 62.5,43 67.5,43.5 67,47 67.5,39 71,38.5 73.5,50 76,58 86,63 86,61 77.5,38.5 80.5,39 86.13,31.99 83,25.5 81,34.5 78.5,33.5 71,31.5 73.5,31.5 75,12.5 73,15.5 70,14.5 68,14.5 62.5,18.5 64.5,18.5 65,13.5 62.5,8.5 62.5,3.5 85.5,13.5 84.5,17 83,21 39,19.5 42,20.5 38.02,37.39 38.02,39.64 43.27,33.14 51.37,36.24 47.57,34.74 47.27,32.24 37.47,34.04 42.12,29.59 39.22,26.89 72.22,46.59 70.82,49.19 71.32,42.99 76.8,44.91 76.82,40.79 76.52,52.49 74.02,59.09 74.5,25.7 78.9,26.1 74.3,23.8 55.5,18.9 59.5,21.4 30.9,58.4 65.28,25.08 53.7,21.7 43,16.2 71.8,28.9 84.92,44.33 86.23,41.9
  pour Top: 0.4,64.5 87.6,64.5 87.6,0.4 0.4,0.4
  pour Bottom: 0.4,64.5 87.6,64.5 87.6,0.4 0.4,0.4
LED_FIVE
  Top 0.254: LED5.A 26.26,45.27 U3.14
LED_FOUR
  Top 0.254: U3.15 25.21,45.19 25.21,47.22 25.21,54.1 22.32,56.99 LED4.A
LED_ONE
  Top 0.254: U3.21 10.26,53.36 LED1.A
LED_SEVEN
  Top 0.254: U3.12 27.75,46.05 27.75,54.1 31.31,57.66 33.47,57.66 34.26,58.45 LED7.A
LED_SIX
  Top 0.254: U3.13 27.12,45.55 27.12,54.99 30.2,58.07 LED6.A
LED_THREE
  Top 0.254: U3.19 18.39,47.49 LED3.A
LED_TWO
  Top 0.254: U3.20 14.2,50.55 LED2.A
LED_ZERO
  Top 0.254: U3.22 6.2,56.29 LED0.A
N$1
  Top 0.254: Q5.1 36.83,26.48 38.29,27.94 40.1,27.94 40.83,28.67 40.83,37.97 38.16,40.64 37.48,40.64 U3.1
N$2  (via drill 0.35)
  Top 0.254: R20.2 22.23,24 v27.81,24 | v34.67,23.5 35.71,23.5 Q5.3
  Bottom 0.254: v27.81,24 34.16,24 v34.67,23.5
N$3
  Top 0.254: U1.8 73.72,25.53 75.63,23.62 C16.1
N$4
  Top 0.254: U1.25 72.72,43.8 70.08,46.44 C3.2 C6.1 65.44,48.81 R47.1
N$5
  Top 0.254: U1.21 74.72,52.05 76.86,54.19 C7.1 81.12,54.19 R11.1
N$6
  Top 0.254: U1.27 71.72,35.02 70.3,36.45 69.19,36.45 C1.1 67.5,36.62 66.74,37.38 66.74,40.55 66.02,41.27 R5.1
N$7  (via drill 0.35)
  Top 0.254: J7.5 46.67,48.9 45.53,47.75 v43.75,47.75 | v38.29,34.8 36.74,34.8 U3.42 | v40.05,37.34 v40.05,35.16
  Bottom 0.254: v43.75,47.75 41.34,47.75 39.94,46.35 39.94,37.44 v40.05,37.34 | v40.05,35.16 39.69,34.8 v38.29,34.8
N$8
  Top 0.254: R9.2 86.04,28.43 Q1.2
N$9  (via drill 0.35)
  Top 0.254: v36.39,34.16 36.13,34.42 35.99,34.42 U3.41 | J7.4 41.4,48.07 41.4,34.42 41.78,34.04 41.78,33.19 v41.74,33.15
  Bottom 0.254: v41.74,33.15 37.34,33.15 36.39,34.1 v36.39,34.16
N$10
  Top 0.254: U1.20 75.22,46.59 76.94,48.3 C8.2 | C8.2 C5.1 | R12.1 79.22,48.26 C8.2
N$11
  Top 0.254: R16.2 86.17,22.74 | R9.1 86.17,23.94 86.17,22.74 | D4.A 86.17,22.74
N$12
  Top 0.254: R53.2 85.28,47.77 85.28,61.59 83.92,62.96 J2.12
N$13
  Top 0.254: U1.18 76.22,34.67 | 76.22,34.67 76.22,38.82 77.66,40.26 79.1,40.26 C46.2 | U1.17 76.72,34.62 76.68,34.67 76.22,34.67 | R8.1 81.41,41.13 80.46,40.17 C46.2 | C46.2 C9.1
N$14
  Top 0.254: R51.2 32.16,61.05 LED7.C
N$15  (via drill 0.35)
  Top 0.254: R44.2 78.16,14.8 Q2.3 79.77,14.81 v79.82,14.86 | v85.92,17.02 85.92,18.41 | R16.1 86.17,18.67 85.92,18.41 | D4.C 83.81,18.03 85.54,18.03 85.92,18.41
  Bottom 0.254: v79.82,14.86 84.65,14.86 85.92,16.13 v85.92,17.02
N$16
  Top 0.254: U1.16 77.22,34.74 78.34,35.85 C9.2 | C9.2 79.19,34.42 80.26,33.34 81.34,33.34 81.79,32.89 81.79,31.96 D6.A | R15.1 83.63,33.02 80.8,35.85 C9.2
N$17
  Top 0.254: R50.2 28.1,60.8 LED6.C
N$18
  Top 0.254: R6.2 60.9,47.06 60.9,57.53 62.42,59.05 72.33,59.05 72.89,59.62 J2.3
N$19
  Top 0.762: Q3.1 71.31,16.64 72.96,18.29 81.47,18.29 83.25,16.51 Q2.1
N$20
  Top 0.254: 69.15,54.57 71.73,54.57 74.22,52.08 U1.22 74.22,32.01 74.6,31.64 D5.A | 69.15,54.57 C47.2 | R10.1 65.4,55.63 68.9,55.63 69.15,55.37 69.15,54.57
N$21
  Top 0.254: U1.14 76.72,25.91 77.03,25.61 77.03,23.88 | C18.1 78.41,21.1 77.03,22.48 77.03,23.88 | U1.12 75.76,27.5 75.76,26.04 75.22,26.04 | U1.11 75.22,26.04 | 75.22,26.04 75.22,25.04 76.39,23.88 77.03,23.88
N$22
  Top 0.254: R12.2 84.27,49.34 84.27,59.44 83.28,60.42 J2.11
N$23
  Top 0.254: R25.2 61.59,63.02 7V4.A
N$24  (via drill 0.35)
  Top 0.254: R8.2 84.71,42.96 86.42,44.68 v86.42,58.55
  Bottom 0.254: v86.42,58.55 86.42,59.05 83.76,61.72 81.75,61.72 J2.10
N$25
  Top 0.254: R47.2 61.41,50.1 61.41,57.28 62.55,58.42 74.74,58.42 75.44,59.11 J2.5
N$26  (via drill 0.35)
  Top 0.254: U1.6 72.71,27.55 v72.71,28.96 | v65.34,27.43 65.2,27.57 D1.C
  Bottom 0.254: v72.71,28.96 71.69,29.97 68.75,29.97 TS1.2 67.9,28.21 67.12,27.43 v65.34,27.43
N$27
  Top 0.152: C25.1 C26.1
  Top 0.254: C25.1 41.55,13.03 41.53,13.05 C22.1 41.66,13.18 R34.1 | R26.2 41.66,4.19 | 41.66,4.19 R32.2 41.72,1.97 | 41.66,4.19 41.55,4.29 C23.1 C26.1
  Top 0.61: U7.5 45.31,2.54 43.05,2.54 42.42,1.91 41.78,1.91 41.72,1.97
N$28
  Top 0.254: C17.1 73.22,22.53 U1.7
N$29
  Top 0.254: U1.24 73.22,34.8 | 73.22,34.8 73.22,48.25 70.97,50.51 C6.2 69.03,51.82 | U1.23 73.72,34.8 73.22,34.8 | C47.1 69.03,51.82 | R23.1 65.28,51.82 69.03,51.82
N$30
  Top 0.254: Q3.3 66.66,15.37 67.38,15.37 67.76,15.75 67.76,19.68 | R45.2 69.21,19.68 67.76,19.68 | 67.76,19.68 66.3,19.68 R46.1
N$31
  Top 0.254: LS1.1 23.37,19.68 22.16,20.89 R20.1
N$32
  Top 0.254: R14.1 51.79,61.24 3V3.A
N$33
  Top 0.254: R49.2 24.16,60.8 LED5.C
N$36  (via drill 0.35)
  Top 0.254: v63.06,53.47 63.12,53.4 R23.2
  Bottom 0.254: v63.06,53.47 73.34,53.47 77.97,58.1 J2.7
N$37
  Top 0.254: U3.7 34.24,44.2 34.99,44.2 35.54,44.74 C20.1
N$40
  Top 0.254: R48.2 20.22,60.8 LED4.C
N$41
  Top 0.254: R21.1 16.29,60.8 LED3.C
N$42
  Top 0.254: R22.1 12.1,60.93 LED2.C
N$43
  Top 0.254: LED1.C 8.16,60.93 R13.1
N$44
  Top 0.254: R37.1 4.09,60.93 LED0.C
N$49
  Top 0.254: C24.1 R27.1 41.94,56.81 41.21,57.53 35.24,57.53 34.86,57.15 R28.1
N$50
  Top 0.254: S2.B2 47.34,63.21 48.09,62.46 R29.2
N$51  (via drill 0.35)
  Top 0.61: U7.6 43.66,1.61 v43.56,1.71
  Top 0.762: v45.53,4.7 45.7,4.87 C28.2 45.7,13.56 L1.2 45.85,18.86 43.7,21.01 L2.2
  Bottom 0.762: v45.53,4.7 43.94,3.11 43.56,2.73 v43.56,1.71
N$52  (via drill 0.35)
  Top 0.254: 47.44,6.31 C28.1
  Top 0.762: U7.1 47.97,1.65 v49.09,1.65 | v48.58,4.95 47.82,4.95 47.44,5.33 47.44,6.31
  Bottom 0.762: v49.09,1.65 49.72,2.29 49.72,4.57 49.34,4.95 v48.58,4.95
N$53
  Top 0.254: U7.3 50.32,3.51 R31.2 50.35,4.38 49.78,4.95 R30.1
N$54
  Top 0.254: U7.4 44.31,3.51 43.75,4.06 43.75,18.03 42.61,19.18 40.58,19.18 39.76,18.35 R35.1 R34.2
N$56
  Top 0.254: 16.26,33.4 R39.2 16.2,33.27 | 16.26,33.4 16.26,37.72 17.11,38.57 U5.7 | 16.26,33.4 17.53,33.4 17.78,33.15 17.78,27.43 20.19,25.02 20.19,18.67 19.81,18.29 17.92,18.29 J3.P$2
N$57
  Top 0.254: R40.2 8.86,46.51 5V3.A
N$58  (via drill 0.35)
  Top 0.254: 5V4.A 13.3,43.56 v14.35,43.56 | v14.86,46.61 R41.2
  Bottom 0.254: v14.35,43.56 15.11,44.32 15.11,46.35 v14.86,46.61
N$59  (via drill 0.35)
  Top 0.254: R39.1 16.38,31.31 v16.38,28.83 16.38,23.5 15.56,22.67 15.56,20.77 16.01,20.31 J3.P$1 | v20.45,37.08 20.23,37.3 U5.6
  Bottom 0.254: v16.38,28.83 18.92,28.83 20.45,30.35 v20.45,37.08
N$61
  Top 0.254: 28V.A 66.77,61.31 R42.2
N$62
  Top 0.254: R43.2 56.64,63.02 5V.A
N$63
  Top 0.254: U$3.1 61.53,6.35 61.53,7.75 61.15,8.13 U9.1
N$64
  Top 0.254: U$3.3 57.6,8.13 | U9.2 58.87,9.4 57.6,8.13 | 57.6,8.13 56.33,9.4 U9.7
N$65
  Top 0.254: U$3.5 53.79,6.22 53.79,7.75 54.17,8.13 U9.8
N$66
  Top 0.254: U1.19 75.72,42.13 77.83,44.23 C5.2 | C5.2 79.25,44.17 79.25,41.93 C46.1 | R53.1 81.31,44.73 80.81,44.23 C5.2
OSC1
  Top 0.254: R1.1 25.26,32.64 26.08,32.64 U3.30 | R1.1 23.49,30.86 22.29,30.86 21.77,30.34 U$5.3 | R1.1 23.81,32.13 22.42,32.13 22.03,31.75 C12.2
OSC2
  Top 0.254: R1.2 25.68,30.32 26.35,30.99 26.35,31.78 U3.31 | R1.2 24.83,29.52 24.83,27.3 24.32,26.79 U$5.1 | R1.2 26.01,30.32 26.86,29.46 C11.2
PACK+  (via drill 0.35)
  Top 0.254: J2.8 77.97,62.67 77.03,61.72 69.66,61.72 67.5,59.56 60.39,59.56 59.37,58.55 59.37,57.59 R2.2 55.94,57.47 54.42,55.95 Q4.3 | R15.2 83.59,34.92 v81.52,36.99
  Bottom 0.254: v81.52,36.99 81.52,55.83 79.3,58.06 79.3,60.92 79.31,60.94 79.31,62.36 78.71,62.96 J2.8
PACK-  (via drill 0.35)
  Top 0.762: R44.1 75.69,16.89 v81.34,16.89 81.34,7.11 Q2.TAB
  Bottom 0.762: J2.1 63.02,60.42 57.22,54.61 57.22,27.69 65.22,19.68 79.44,19.68 81.34,17.78 v81.34,16.89
REGSRC  (via drill 0.35)
  Top 0.254: Q4.2 55.37,50.92 C42.1 58.16,50.73 v58.23,50.8 | U1.9 74.22,29.05 v74.07,29.21
  Bottom 0.254: v74.07,29.21 72.07,31.2 72.07,43.69 70.17,45.59 59.88,45.59 58.23,47.24 v58.23,50.8
RSNS
  Top 0.254: R18.2 R19.2 70.74,21.91 70.93,21.72 70.93,18.41 70.23,17.72 R45.1 69.34,17.66 69.34,16 68.83,15.49 68.77,15.43 Q3.TAB
RST  (via drill 0.35)
  Top 0.254: R29.1 46.17,56 43.88,56 | R27.2 43.88,56 | J7.1 40.07,54.36 43.12,54.36 43.88,55.12 43.88,56 | U3.18 v27.24,39.77
  Bottom 0.254: J7.1 36.51,44.45 31.83,39.77 v27.24,39.77
SCL  (via drill 0.35)
  Top 0.254: U3.38 v35.37,31.64 R24.2 | v36.88,29.66 36.9,29.65 v36.9,27.56 | v41.85,22.35 v39.03,22.35 | v49.34,22.35 51.25,22.35 v51.75,21.84 | v64.83,22.99 64.83,21.21 63.56,19.94 v61.79,19.94 | v71.97,24.4 72.22,24.66 U1.5 | U9.5 v52.58,11.94
  Bottom 0.254: v35.37,31.64 36.5,31.64 36.88,31.25 v36.88,29.66 | v36.9,27.56 39.03,25.42 v39.03,22.35 39.03,21.63 38.06,20.66 12.59,20.66 4.83,28.42 4.83,32 3.81,33.02 J1.2 | v41.85,22.35 v49.34,22.35 49.34,15.18 v52.58,11.94 | v51.75,21.84 53.66,19.94 v61.79,19.94 | v64.83,22.99 66.25,24.4 v71.97,24.4
SDA  (via drill 0.35)
  Top 0.254: U3.37 33.34,32.54 v33.34,32 33.34,31.62 32.96,31.24 R7.2 30.92,30.16 30.23,29.46 v30.23,27.43 | v59.25,24 59.5,24.26 v59.5,26.92 | v71.57,25.4 71.72,25.56 U1.4 | v46.04,32.13 46.93,31.24 v51.5,31.24 | U9.4 61.34,11.94 v61.85,12.45
  Bottom 0.254: v51.5,31.24 52.52,30.23 52.52,29.72 58.23,24 v59.25,24 63.75,19.5 63.75,14.35 v61.85,12.45 | v46.04,32.13 45.78,32.38 33.72,32.38 v33.34,32 | v59.5,26.92 64.45,26.92 65.98,25.4 v71.57,25.4 | v30.23,27.43 20.19,27.43 19.94,27.69 12.83,27.69 4.95,35.56 J1.3
SRN
  Top 0.254: U1.29 70.72,34.5 70.3,34.92 66.36,34.92 | R18.1 66.36,23.94 66.36,34.92 | 62.74,34.92 62.67,34.99 C14.1 | C15.2 59.31,34.92 62.74,34.92 | 66.36,34.92 62.74,34.92
SRP
  Top 0.254: U1.28 71.22,34.63 70.42,35.43 67.5,35.43 66.29,36.64 66.29,37.72 65.98,38.03 R17.1 C14.2 C13.1
TS2  (via drill 0.35)
  Top 0.254: U1.13 76.22,25.31 v76.27,25.27
  Bottom 0.254: v76.27,25.27 77.51,24.02 TS2.2
VC1
  Top 0.254: U1.26 72.22,40.49 70.33,42.38 C2.2 C3.1 68.94,44.83 R6.1
VC5X  (via drill 0.35)
  Top 0.254: C41.2 58.48,49.09 58.48,47.62 | 54.29,47.62 58.48,47.62 | C7.2 79.19,51.31 | 79.19,51.31 C8.1 82.97,50 v83.19,49.78 | 58.48,47.62 C43.1 59.54,46.03 60.11,46.61 v60.11,48.01 | v77.41,51.31 79.19,51.31 | R3.1 54.29,44.31 54.29,47.62 | U1.10 74.72,29.07 75.38,29.72 79.25,29.72 79.6,29.36 D5.C 79.6,26.59 v80.26,25.93 | C18.2 80.95,22.6 81.36,23.01 TS2.1 | 54.29,47.62 53.47,48.45 Q4.1
  Bottom 0.254: v60.11,48.01 74.11,48.01 v77.41,51.31 | v83.19,49.78 82.36,48.96 82.36,40.1 82.36,40.09 82.36,28.02 v80.26,25.93 81.36,24.83 TS2.1

### Text on the board
tPlace: TX | RX | GND | Gina Lanese / Juice Board / Spring 2020 | SDA | SCL | GND
bPlace: PACK+ | +24V | 8-/7+ | 7-/6+ | GND | NC | PACK- | 2-/1+ | 3-/2+ | 4-/3+ | 5-/4+ | 6-/5+ | 1-/2+ | 2- | 1- | +7V4 | GND | NC